# Altium project MASTER.PrjPcb (part 2 of 3)

## Sheet Vesc_Simple_2.SchDoc
size C
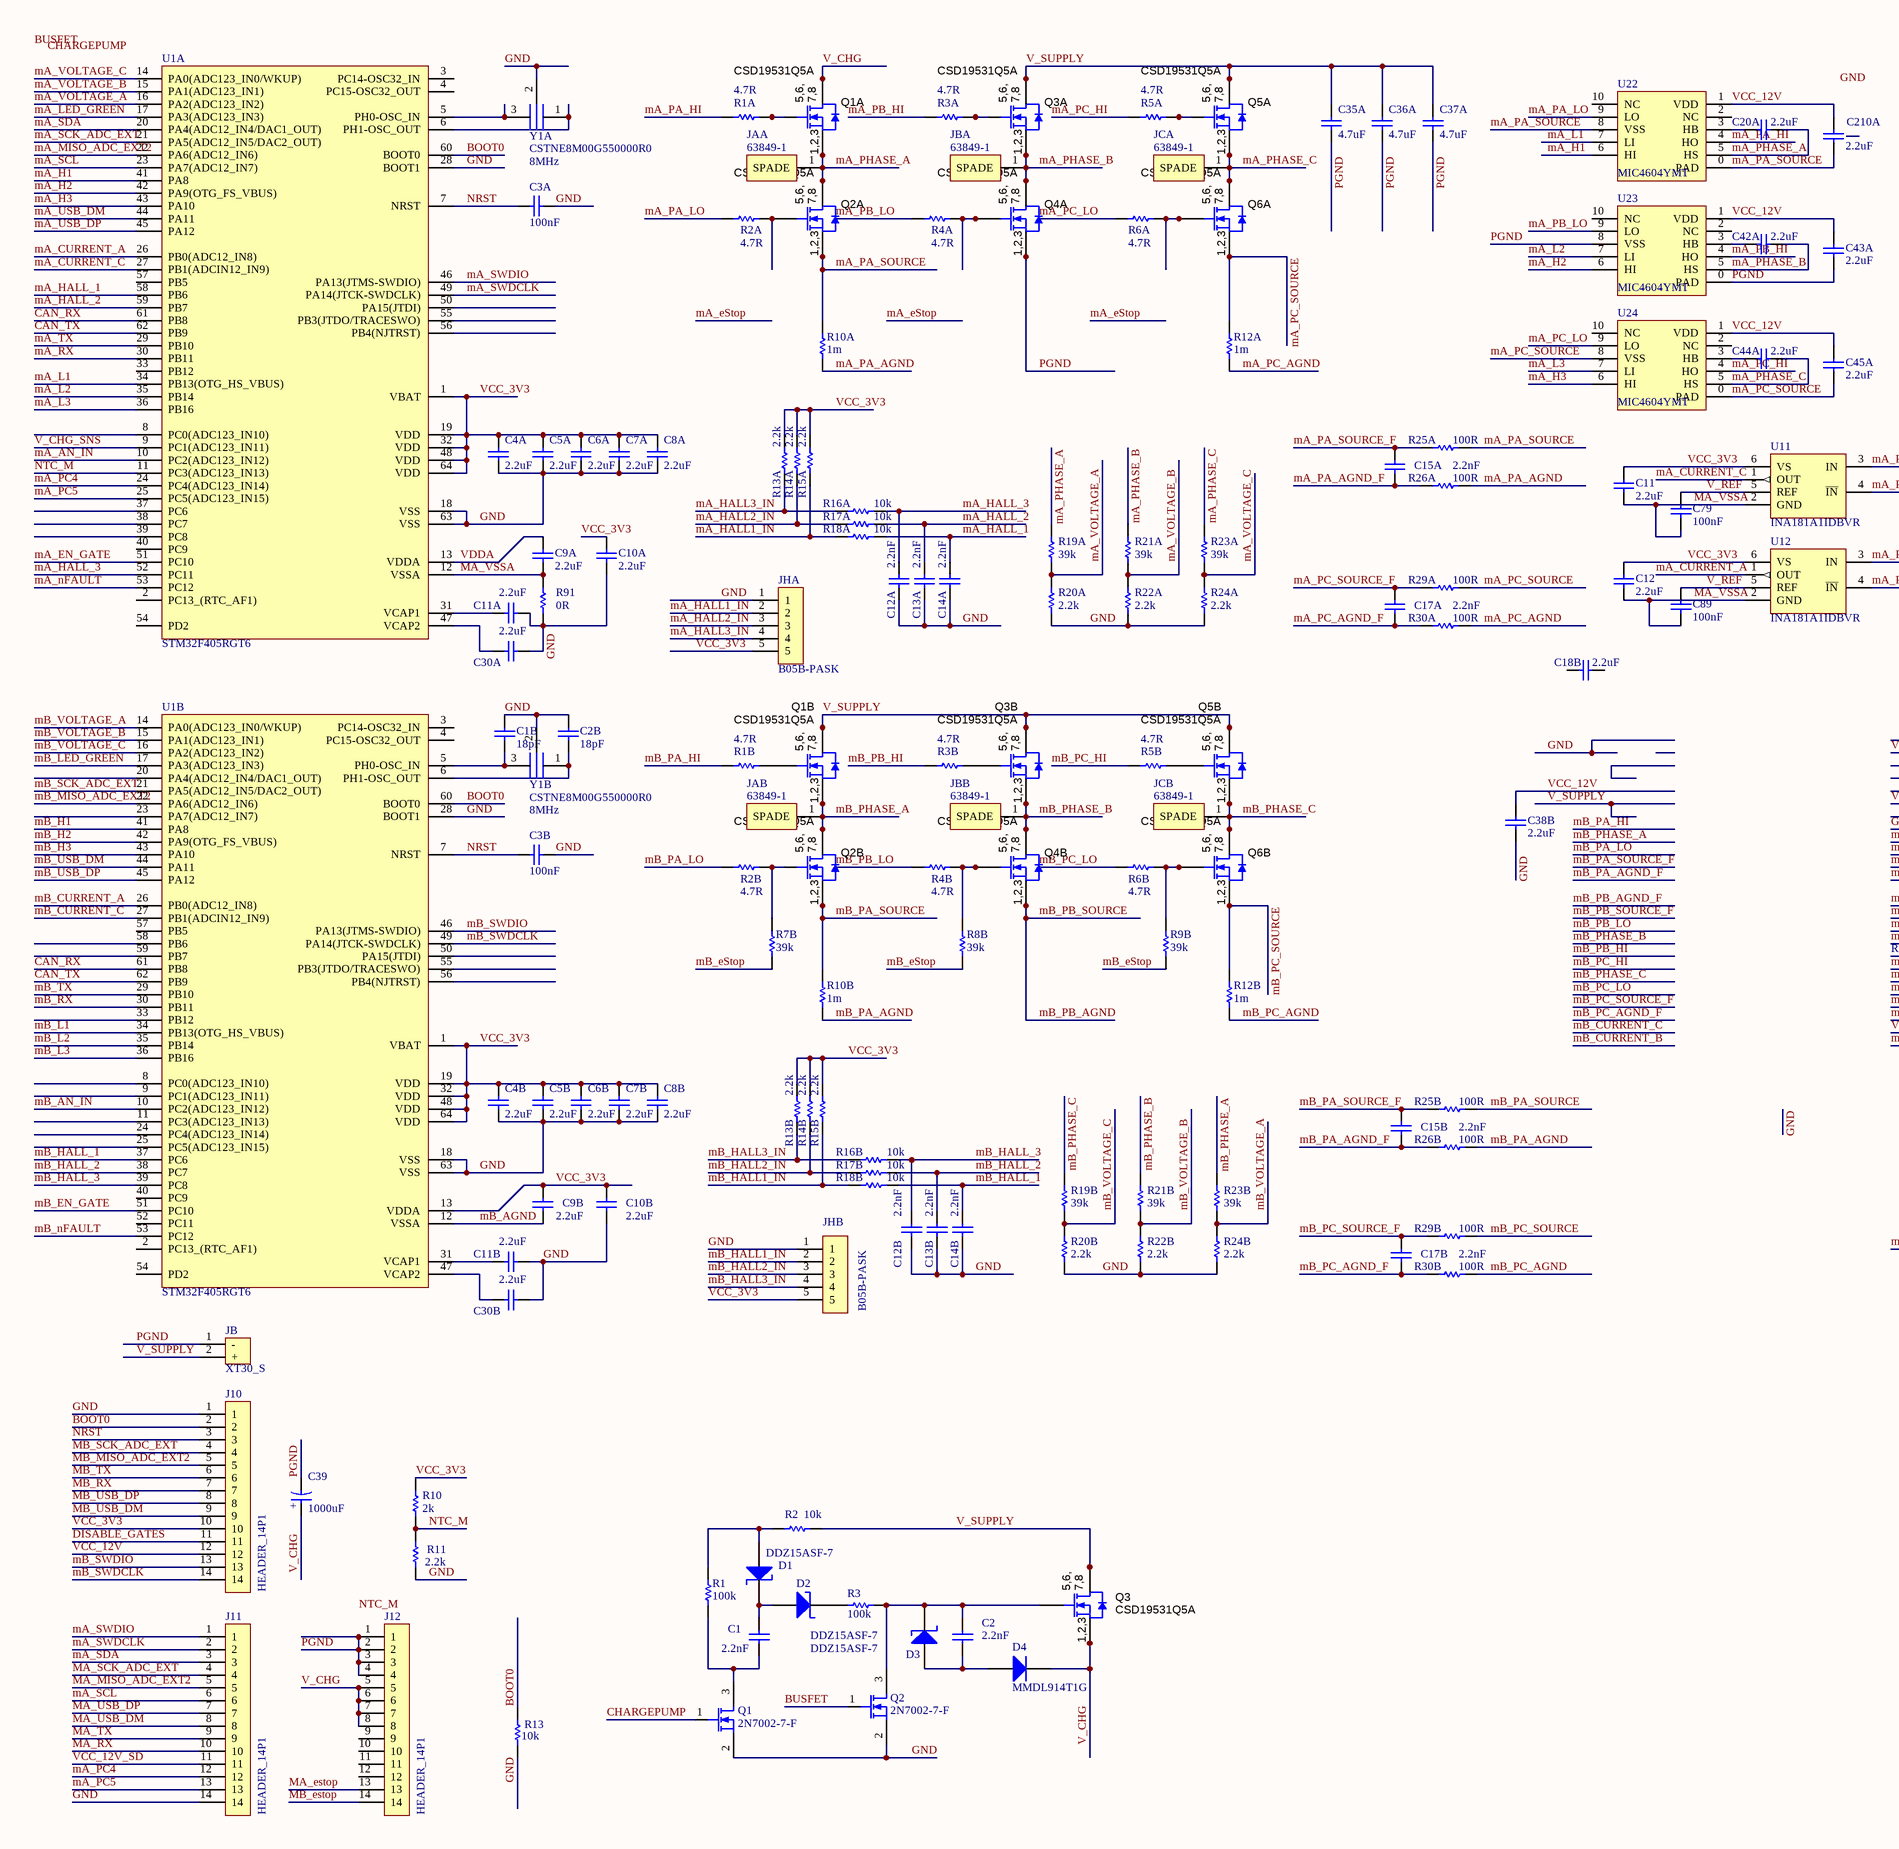
[diagram p3: Vesc_Simple_2.SchDoc, left]
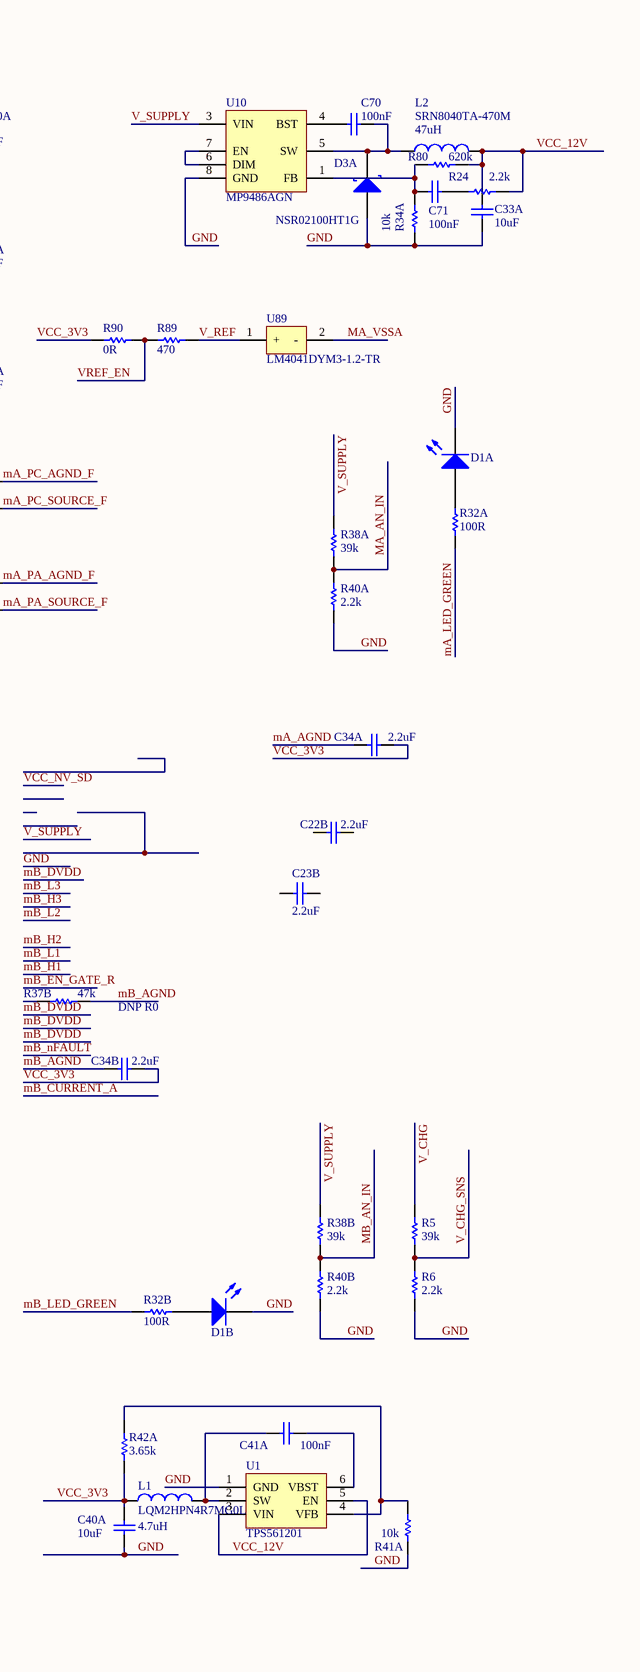
[diagram p4: Vesc_Simple_2.SchDoc, right]

### Parts
(Parts that share a designator on the sheet are numbered #1, #2 ... from top to bottom, then left to right.)
C1  value 2.2nF  [CAP 0402]  (hidden comment: GCM155R72A222KA37D)
C1B#2  value 18pF  [CAP 0402]  (hidden comment: GCM1555C1H180JA16D)
C2  value 2.2nF  [CAP 0402]  (hidden comment: GCM155R72A222KA37D)
C2B#2  value 18pF  [CAP 0402]  (hidden comment: GCM1555C1H180JA16D)
C3A#2  value 100nF  [CAP 0402]  (hidden comment: C0402C104K3RACTU)
C3B#2  value 100nF  [CAP 0402]  (hidden comment: C0402C104K3RACTU)
C4A#2  value 2.2uF  [CAP 0402]  (hidden comment: GRM155C81C225ME15D)
C4B#2  value 2.2uF  [CAP 0402]  (hidden comment: GRM155C81C225ME15D)
C5A#2  value 2.2uF  [CAP 0402]  (hidden comment: GRM155C81C225ME15D)
C5B#2  value 2.2uF  [CAP 0402]  (hidden comment: GRM155C81C225ME15D)
C6A#2  value 2.2uF  [CAP 0402]  (hidden comment: GRM155C81C225ME15D)
C6B#2  value 2.2uF  [CAP 0402]  (hidden comment: GRM155C81C225ME15D)
C7A#2  value 2.2uF  [CAP 0402]  (hidden comment: GRM155C81C225ME15D)
C7B#2  value 2.2uF  [CAP 0402]  (hidden comment: GRM155C81C225ME15D)
C8A#2  value 2.2uF  [CAP 0402]  (hidden comment: GRM155C81C225ME15D)
C8B#2  value 2.2uF  [CAP 0402]  (hidden comment: GRM155C81C225ME15D)
C9A#2  value 2.2uF  [CAP 0402]  (hidden comment: GRM155C81C225ME15D)
C9B#2  value 2.2uF  [CAP 0402]  (hidden comment: GRM155C81C225ME15D)
C10A#2  value 2.2uF  [CAP 0402]  (hidden comment: GRM155C81C225ME15D)
C10B#2  value 2.2uF  [CAP 0402]  (hidden comment: GRM155C81C225ME15D)
C11#1  value 2.2uF  [CAP 0402]  (hidden comment: GRM155C81C225ME15D)
C11A#2  value 2.2uF  [CAP 0402]  (hidden comment: GRM155C81C225ME15D)
C11B#2  value 2.2uF  [CAP 0402]  (hidden comment: GRM155C81C225ME15D)
C12  value 2.2uF  [CAP 0402]  (hidden comment: GRM155C81C225ME15D)
C12A#2  value 2.2nF  [CAP 0402]  (hidden comment: GCM155R72A222KA37D)
C12B#2  value 2.2nF  [CAP 0402]  (hidden comment: GCM155R72A222KA37D)
C13A#2  value 2.2nF  [CAP 0402]  (hidden comment: GCM155R72A222KA37D)
C13B#2  value 2.2nF  [CAP 0402]  (hidden comment: GCM155R72A222KA37D)
C14A#2  value 2.2nF  [CAP 0402]  (hidden comment: GCM155R72A222KA37D)
C14B#2  value 2.2nF  [CAP 0402]  (hidden comment: GCM155R72A222KA37D)
C15A#2  value 2.2nF  [CAP 0402]  (hidden comment: GCM155R72A222KA37D)
C15B#2  value 2.2nF  [CAP 0402]  (hidden comment: GCM155R72A222KA37D)
C17A#2  value 2.2nF  [CAP 0402]  (hidden comment: GCM155R72A222KA37D)
C17B#2  value 2.2nF  [CAP 0402]  (hidden comment: GCM155R72A222KA37D)
C18B#2  value 2.2uF  [CAP 0402]  (hidden comment: GRM155C81C225ME15D)
C20A#2  value 2.2uF  [CAP 0402]  (hidden comment: GRM155C81C225ME15D)
C22B#2  value 2.2uF  [CAP 0402]  (hidden comment: GRM155C81C225ME15D)
C23B#2  value 2.2uF  [CAP 0402]  (hidden comment: GRM155C81C225ME15D)
C30A#2  value 2.2uF  [CAP 0402]  (hidden comment: GRM155C81C225ME15D)
C30B#2  value 2.2uF  [CAP 0402]  (hidden comment: GRM155C81C225ME15D)
C33A#2  value 10uF  [CAP 1206]  (hidden comment: TMK316AB7106KL-T)
C34A#2  value 2.2uF  [CAP 0402]  (hidden comment: GRM155C81C225ME15D)
C34B#2  value 2.2uF  [CAP 0402]  (hidden comment: GRM155C81C225ME15D)
C35A#2  value 4.7uF  [CAP 1210]  (hidden comment: CGA6M3X7S2A475M200AB)
C36A#2  value 4.7uF  [CAP 1210]  (hidden comment: CGA6M3X7S2A475M200AB)
C37A#2  value 4.7uF  [CAP 1210]  (hidden comment: CGA6M3X7S2A475M200AB)
C38B#2  value 2.2uF  [CAP 0402]  (hidden comment: GRM155C81C225ME15D)
C39#2  value 1000uF  [CAP 7.5mm Bent]  (hidden comment: 108CKS100MRY)
C40A#1  value 10uF  [CAP 1206]  (hidden comment: TMK316AB7106KL-T)
C41A#1  value 100nF  [CAP 0402]  (hidden comment: C0402C104K3RACTU)
C42A  value 2.2uF  [CAP 0402]  (hidden comment: GRM155C81C225ME15D)
C43A  value 2.2uF  [CAP 0402]  (hidden comment: GRM155C81C225ME15D)
C44A  value 2.2uF  [CAP 0402]  (hidden comment: GRM155C81C225ME15D)
C45A  value 2.2uF  [CAP 0402]  (hidden comment: GRM155C81C225ME15D)
C70  value 100nF  [CAP 0402]  (hidden comment: C0402C104K3RACTU)
C71  value 100nF  [CAP 0402]  (hidden comment: C0402C104K3RACTU)
C79  value 100nF  [CAP 0402]  (hidden comment: C0402C104K3RACTU)
C89  value 100nF  [CAP 0402]  (hidden comment: C0402C104K3RACTU)
C210A  value 2.2uF  [CAP 0402]  (hidden comment: GRM155C81C225ME15D)
D1  DDZ15ASF-7  [SOD-323/SC76]
D1A#2  LTST-C190KRKT  [LED 0603]  (value not drawn)
D1B#2  LTST-C190KRKT  [LED 0603]  (value not drawn)
D2  DDZ15ASF-7  [SOD-323/SC76]
D3  DDZ15ASF-7  [SOD-323/SC76]
D3A#2  NSR02100HT1G  [SOD-323/SC76]
D4  MMDL914T1G  [SOD-323/SC76]
J10#3  HEADER_14P1  [HEADER_14P1_FEMALE_TH]
J11#3  HEADER_14P1  [HEADER_14P1_FEMALE_TH]
J12#3  HEADER_14P1  [HEADER_14P1_FEMALE_TH]
JAA#2  63849-1  [63849-1]
JAB#2  63849-1  [63849-1]
JB#3  XT30_S  [XT30 SOCKET]
JBA#2  63849-1  [63849-1]
JBB#2  63849-1  [63849-1]
JCA#2  63849-1  [63849-1]
JCB#2  63849-1  [63849-1]
JHA#2  B05B-PASK  [B05B-PASK]
JHB#2  B05B-PASK  [B05B-PASK]
L1#1  LQM2HPN4R7MG0L  value 4.7uH  [IND 1008]
L2  SRN8040TA-470M  value 47uH  [SRN8040TA]
Q1  2N7002-7-F  [SOT-23-3]
Q1A#2  CSD19531Q5A  [VSONP-8]
Q1B#2  CSD19531Q5A  [VSONP-8]
Q2  2N7002-7-F  [SOT-23-3]
Q2A#2  CSD19531Q5A  [VSONP-8]
Q2B#2  CSD19531Q5A  [VSONP-8]
Q3  CSD19531Q5A  [VSONP-8]
Q3A#2  CSD19531Q5A  [VSONP-8]
Q3B#2  CSD19531Q5A  [VSONP-8]
Q4A#2  CSD19531Q5A  [VSONP-8]
Q4B#2  CSD19531Q5A  [VSONP-8]
Q5A#2  CSD19531Q5A  [VSONP-8]
Q5B#2  CSD19531Q5A  [VSONP-8]
Q6A#2  CSD19531Q5A  [VSONP-8]
Q6B#2  CSD19531Q5A  [VSONP-8]
R1  value 100k  [RES 0402]  (hidden comment: ERJ-2RKF1003X)
R1A#2  value 4.7R  [RES 0402]  (hidden comment: ERJ-PA3J4R7V)
R1B#2  value 4.7R  [RES 0402]  (hidden comment: ERJ-PA3J4R7V)
R2#1  value 10k  [RES 0402]  (hidden comment: ERJ-2RKF1002X)
R2A#2  value 4.7R  [RES 0402]  (hidden comment: ERJ-PA3J4R7V)
R2B#2  value 4.7R  [RES 0402]  (hidden comment: ERJ-PA3J4R7V)
R3#1  value 100k  [RES 0402]  (hidden comment: ERJ-2RKF1003X)
R3A#2  value 4.7R  [RES 0402]  (hidden comment: ERJ-PA3J4R7V)
R3B#2  value 4.7R  [RES 0402]  (hidden comment: ERJ-PA3J4R7V)
R4A#2  value 4.7R  [RES 0402]  (hidden comment: ERJ-PA3J4R7V)
R4B#2  value 4.7R  [RES 0402]  (hidden comment: ERJ-PA3J4R7V)
R5#1  value 39k  [RES 0402]  (hidden comment: ERJ-2RKF3902X)
R5A#2  value 4.7R  [RES 0402]  (hidden comment: ERJ-PA3J4R7V)
R5B#2  value 4.7R  [RES 0402]  (hidden comment: ERJ-PA3J4R7V)
R6#1  value 2.2k  [RES 0402]  (hidden comment: ERJ-2RKF2201X)
R6A#2  value 4.7R  [RES 0402]  (hidden comment: ERJ-PA3J4R7V)
R6B#2  value 4.7R  [RES 0402]  (hidden comment: ERJ-PA3J4R7V)
R7B#2  value 39k  [RES 0402]  (hidden comment: ERJ-2RKF3902X)
R8B#2  value 39k  [RES 0402]  (hidden comment: ERJ-2RKF3902X)
R9B#2  value 39k  [RES 0402]  (hidden comment: ERJ-2RKF3902X)
R10#2  value 2k  [RES 0402]  (hidden comment: ERT-J0EG202GM)
R10A#2  value 1m  [WSL2726]  (hidden comment: WSL27262L000FEB)
R10B#2  value 1m  [WSL2726]  (hidden comment: WSL27262L000FEB)
R11#2  value 2.2k  [RES 0402]  (hidden comment: ERJ-2RKF2201X)
R12A#2  value 1m  [WSL2726]  (hidden comment: WSL27262L000FEB)
R12B#2  value 1m  [WSL2726]  (hidden comment: WSL27262L000FEB)
R13#2  value 10k  [RES 0402]  (hidden comment: ERJ-2RKF1002X)
R13A#3  value 2.2k  [RES 0402]  (hidden comment: ERJ-2RKF2201X)
R13B#3  value 2.2k  [RES 0402]  (hidden comment: ERJ-2RKF2201X)
R14A#3  value 2.2k  [RES 0402]  (hidden comment: ERJ-2RKF2201X)
R14B#3  value 2.2k  [RES 0402]  (hidden comment: ERJ-2RKF2201X)
R15A#2  value 2.2k  [RES 0402]  (hidden comment: ERJ-2RKF2201X)
R15B#2  value 2.2k  [RES 0402]  (hidden comment: ERJ-2RKF2201X)
R16A#2  value 10k  [RES 0402]  (hidden comment: ERJ-2RKF1002X)
R16B#2  value 10k  [RES 0402]  (hidden comment: ERJ-2RKF1002X)
R17A#2  value 10k  [RES 0402]  (hidden comment: ERJ-2RKF1002X)
R17B#2  value 10k  [RES 0402]  (hidden comment: ERJ-2RKF1002X)
R18A#2  value 10k  [RES 0402]  (hidden comment: ERJ-2RKF1002X)
R18B#2  value 10k  [RES 0402]  (hidden comment: ERJ-2RKF1002X)
R19A#2  value 39k  [RES 0402]  (hidden comment: ERJ-2RKF3902X)
R19B#2  value 39k  [RES 0402]  (hidden comment: ERJ-2RKF3902X)
R20A#2  value 2.2k  [RES 0402]  (hidden comment: ERJ-2RKF2201X)
R20B#2  value 2.2k  [RES 0402]  (hidden comment: ERJ-2RKF2201X)
R21A#2  value 39k  [RES 0402]  (hidden comment: ERJ-2RKF3902X)
R21B#2  value 39k  [RES 0402]  (hidden comment: ERJ-2RKF3902X)
R22A#2  value 2.2k  [RES 0402]  (hidden comment: ERJ-2RKF2201X)
R22B#2  value 2.2k  [RES 0402]  (hidden comment: ERJ-2RKF2201X)
R23A#2  value 39k  [RES 0402]  (hidden comment: ERJ-2RKF3902X)
R23B#2  value 39k  [RES 0402]  (hidden comment: ERJ-2RKF3902X)
R24  value 2.2k  [RES 0402]  (hidden comment: ERJ-2RKF2201X)
R24A#2  value 2.2k  [RES 0402]  (hidden comment: ERJ-2RKF2201X)
R24B#2  value 2.2k  [RES 0402]  (hidden comment: ERJ-2RKF2201X)
R25A#2  value 100R  [RES 0402]  (hidden comment: ERJ-2RKF1000X)
R25B#2  value 100R  [RES 0402]  (hidden comment: ERJ-2RKF1000X)
R26A#2  value 100R  [RES 0402]  (hidden comment: ERJ-2RKF1000X)
R26B#2  value 100R  [RES 0402]  (hidden comment: ERJ-2RKF1000X)
R29A#2  value 100R  [RES 0402]  (hidden comment: ERJ-2RKF1000X)
R29B#2  value 100R  [RES 0402]  (hidden comment: ERJ-2RKF1000X)
R30A#2  value 100R  [RES 0402]  (hidden comment: ERJ-2RKF1000X)
R30B#2  value 100R  [RES 0402]  (hidden comment: ERJ-2RKF1000X)
R32A#2  value 100R  [RES 0402]  (hidden comment: ERJ-2RKF1000X)
R32B#2  value 100R  [RES 0402]  (hidden comment: ERJ-2RKF1000X)
R34A#2  value 10k  [RES 0402]  (hidden comment: ERJ-2RKF1002X)
R37B#2  value 47k  [RES 0402]  (hidden comment: ERJ-2RKF4702X)
R38A#2  value 39k  [RES 0402]  (hidden comment: ERJ-2RKF3902X)
R38B#2  value 39k  [RES 0402]  (hidden comment: ERJ-2RKF3902X)
R40A#2  value 2.2k  [RES 0402]  (hidden comment: ERJ-2RKF2201X)
R40B#2  value 2.2k  [RES 0402]  (hidden comment: ERJ-2RKF2201X)
R41A#1  value 10k  [RES 0402]  (hidden comment: ERJ-2RKF1002X)
R42A#1  value 3.65k  [RES 0402]  (hidden comment: ERJ-2RKF3651X)
R80  value 620k  [RES 0402]  (hidden comment: ERJ-2RKF6203X)
R89  value 470  [RES 0402]  (hidden comment: ERJ-2RKF4700X)
R90  value 0R  [RES 0402]  (hidden comment: ERJ-2GE0R00X)
R91#1  value 0R  [RES 0402]  (hidden comment: ERJ-2GE0R00X)
U1#1  TPS561201  [SOT-23-6]
U1A#2  STM32F405RGT6  [QFP-64 - P0.5MM]
U1B#2  STM32F405RGT6  [QFP-64 - P0.5MM]
U10  MP9486AGN  [SOIC-8]
U11  INA181A1IDBVR  [SOT-23-6]
U12  INA181A1IDBVR  [SOT-23-6]
U22  MIC4604YMT  [TDFN-10]
U23  MIC4604YMT  [TDFN-10]
U24  MIC4604YMT  [TDFN-10]
U89  LM4041DYM3-1.2-TR  [SOT-23-3]
Y1A#2  CSTNE8M00G550000R0  value 8MHz  [MuRata CSTN]
Y1B#2  CSTNE8M00G550000R0  value 8MHz  [MuRata CSTN]

### Nets
BOOT0: J10#3.2 R13#2.2 U1A#2.60(BOOT0) U1B#2.60(BOOT0)
BUSFET: Q2.1(G)
CAN_RX: U1A#2.61(PB8) U1B#2.61(PB8)
CAN_TX: U1A#2.62(PB9) U1B#2.62(PB9)
CHARGEPUMP: Q1.1(G)
DISABLE_GATES: J10#3.11
GND: C1B#2.2 C2B#2.2 C3A#2.2 C3B#2.2 C4A#2.2 C4B#2.2 C5A#2.2 C5B#2.2 C6A#2.2 C6B#2.2 C7A#2.2 C7B#2.2 C8A#2.2 C8B#2.2 C10A#2.2 C10B#2.2 C11A#2.2 C11B#2.2 C12A#2.1 C12B#2.1 C13A#2.1 C13B#2.1 C14A#2.1 C14B#2.1 C30A#2.2 C30B#2.2 C33A#2.2 C38B#2.2 C40A#1.2 D1A#2.2(K) D1B#2.2(K) D3A#2.1(A) J10#3.1 J11#3.14 JHA#2.1 JHB#2.1 Q1.2(S) Q2.2(S) R6#1.1 R11#2.1 R13#2.1 R20A#2.1 R20B#2.1 R22A#2.1 R22B#2.1 R24A#2.1 R24B#2.1 R34A#2.1 R40A#2.1 R40B#2.1 R41A#1.1 R91#1.1 U1#1.1(GND) U1A#2.18(VSS) U1A#2.28(BOOT1) U1A#2.63(VSS) U1B#2.18(VSS) U1B#2.28(BOOT1) U1B#2.63(VSS) U10.8(GND) Y1A#2.2 Y1B#2.2
mA_AGND: C34A#2.2
mA_AN_IN: R38A#2.1 R40A#2.2 U1A#2.10(PC2(ADC123_IN12))
mA_CURRENT_A: U1A#2.26(PB0(ADC12_IN8)) U12.1(OUT)
mA_CURRENT_C: U1A#2.27(PB1(ADCIN12_IN9)) U11.1(OUT)
mA_EN_GATE: U1A#2.51(PC10)
mA_eStop: J12#3.13
mA_H1: U1A#2.41(PA8) U22.6(HI)
mA_H2: U1A#2.42(PA9(OTG_FS_VBUS)) U23.6(HI)
mA_H3: U1A#2.43(PA10) U24.6(HI)
mA_HALL1_IN: JHA#2.2 R15A#2.1 R18A#2.1
mA_HALL2_IN: JHA#2.3 R14A#3.1 R17A#2.1
mA_HALL3_IN: JHA#2.4 R13A#3.1 R16A#2.1
mA_HALL_1: C14A#2.2 R18A#2.2 U1A#2.58(PB6)
mA_HALL_2: C13A#2.2 R17A#2.2 U1A#2.59(PB7)
mA_HALL_3: C12A#2.2 R16A#2.2 U1A#2.52(PC11)
mA_L1: U1A#2.34(PB13(OTG_HS_VBUS)) U22.7(LI)
mA_L2: U1A#2.35(PB14) U23.7(LI)
mA_L3: U1A#2.36(PB16) U24.7(LI)
mA_LED_GREEN: R32A#2.2 U1A#2.17(PA3(ADC123_IN3))
mA_MISO_ADC_EXT2: J11#3.5 U1A#2.22(PA6(ADC12_IN6))
mA_nFAULT: U1A#2.53(PC12)
mA_PA_AGND: R10A#2.1 R26A#2.2
mA_PA_AGND_F: C15A#2.1 R26A#2.1 U12.3(IN)
mA_PA_HI: R1A#2.1 U22.4(HO)
mA_PA_LO: R2A#2.1 U22.9(LO)
mA_PA_SOURCE: C35A#2.1 C36A#2.1 C37A#2.1 C39#2.1 C43A.2 C210A.2 J12#3.1 J12#3.2 J12#3.3 J12#3.4 JB#3.1(-) Q2A#2.1(S) Q2A#2.2(S) Q2A#2.3(S) Q2B#2.1(S) Q2B#2.2(S) Q2B#2.3(S) Q4A#2.1(S) Q4A#2.2(S) Q4A#2.3(S) R10A#2.2 R10B#2.2 R25A#2.2 R25B#2.2 U22.0(PAD) U22.8(VSS) U23.0(PAD) U23.8(VSS)  [also labelled mB_PA_SOURCE, PGND]
mA_PA_SOURCE_F: C15A#2.2 R25A#2.1 U12.4(~{IN})
mA_PB_HI: R3A#2.1 U23.4(HO)
mA_PB_LO: R4A#2.1 U23.9(LO)
mA_PC4: J11#3.12 U1A#2.24(PC4(ADC123_IN14))
mA_PC5: J11#3.13 U1A#2.25(PC5(ADC123_IN15))
mA_PC_AGND: R12A#2.2 R30A#2.2
mA_PC_AGND_F: C17A#2.1 R30A#2.1 U11.3(IN)
mA_PC_HI: R5A#2.1 U24.4(HO)
mA_PC_LO: R6A#2.1 U24.9(LO)
mA_PC_SOURCE: C45A.2 Q6A#2.1(S) Q6A#2.2(S) Q6A#2.3(S) R12A#2.1 R29A#2.2 U24.0(PAD) U24.8(VSS)
mA_PC_SOURCE_F: C17A#2.2 R29A#2.1 U11.4(~{IN})
mA_PHASE_A: C20A#2.1 JAA#2.1(SPADE) Q1A#2.1(S) Q1A#2.2(S) Q1A#2.3(S) Q2A#2.5(D) Q2A#2.6(D) Q2A#2.7(D) Q2A#2.8(D) Q2A#2.9(D) R19A#2.2 U22.5(HS)
mA_PHASE_B: C42A.1 JBA#2.1(SPADE) Q3A#2.1(S) Q3A#2.2(S) Q3A#2.3(S) Q4A#2.5(D) Q4A#2.6(D) Q4A#2.7(D) Q4A#2.8(D) Q4A#2.9(D) R21A#2.2 U23.5(HS)
mA_PHASE_C: C44A.1 JCA#2.1(SPADE) Q5A#2.1(S) Q5A#2.2(S) Q5A#2.3(S) Q6A#2.5(D) Q6A#2.6(D) Q6A#2.7(D) Q6A#2.8(D) Q6A#2.9(D) R23A#2.2 U24.5(HS)
mA_RX: J11#3.10 U1A#2.30(PB11)
mA_SCK_ADC_EXT: J11#3.4 U1A#2.21(PA5(ADC12_IN5/DAC2_OUT))
mA_SCL: J11#3.6 U1A#2.23(PA7(ADC12_IN7))
mA_SDA: J11#3.3 U1A#2.20(PA4(ADC12_IN4/DAC1_OUT))
mA_SWDCLK: J11#3.2 U1A#2.49(PA14(JTCK-SWDCLK))
mA_SWDIO: J11#3.1 U1A#2.46(PA13(JTMS-SWDIO))
mA_TX: J11#3.9 U1A#2.29(PB10)
mA_USB_DM: J11#3.8 U1A#2.44(PA11)
mA_USB_DP: J11#3.7 U1A#2.45(PA12)
mA_VOLTAGE_A: R19A#2.1 R20A#2.2 U1A#2.16(PA2(ADC123_IN2))
mA_VOLTAGE_B: R21A#2.1 R22A#2.2 U1A#2.15(PA1(ADC123_IN1))
mA_VOLTAGE_C: R23A#2.1 R24A#2.2 U1A#2.14(PA0(ADC123_IN0/WKUP))
MA_VSSA: C9A#2.2 C11#1.2 C12.2 C79.1 C89.1 R91#1.2 U1A#2.12(VSSA) U11.2(GND) U12.2(GND) U89.2(-)
mB_AGND: C9B#2.2 C34B#2.2 R37B#2.2 U1B#2.12(VSSA)
mB_AN_IN: R38B#2.1 R40B#2.2 U1B#2.10(PC2(ADC123_IN12))
mB_CURRENT_A: U1B#2.26(PB0(ADC12_IN8))
mB_CURRENT_C: U1B#2.27(PB1(ADCIN12_IN9))
mB_EN_GATE: U1B#2.51(PC10)
mB_eStop: J12#3.14 R7B#2.1 R8B#2.1 R9B#2.1
mB_H1: U1B#2.41(PA8)
mB_H2: U1B#2.42(PA9(OTG_FS_VBUS))
mB_H3: U1B#2.43(PA10)
mB_HALL1_IN: JHB#2.2 R15B#2.1 R18B#2.1
mB_HALL2_IN: JHB#2.3 R14B#3.1 R17B#2.1
mB_HALL3_IN: JHB#2.4 R13B#3.1 R16B#2.1
mB_HALL_1: C14B#2.2 R18B#2.2 U1B#2.37(PC6)
mB_HALL_2: C13B#2.2 R17B#2.2 U1B#2.38(PC7)
mB_HALL_3: C12B#2.2 R16B#2.2 U1B#2.39(PC8)
mB_L1: U1B#2.34(PB13(OTG_HS_VBUS))
mB_L2: U1B#2.35(PB14)
mB_L3: U1B#2.36(PB16)
mB_LED_GREEN: R32B#2.2 U1B#2.17(PA3(ADC123_IN3))
mB_MISO_ADC_EXT2: J10#3.5 U1B#2.22(PA6(ADC12_IN6))
mB_nFAULT: U1B#2.53(PC12)
mB_PA_AGND: R10B#2.1 R26B#2.2
mB_PA_AGND_F: C15B#2.1 R26B#2.1
mB_PA_HI: R1B#2.1
mB_PA_LO: R2B#2.1
mB_PA_SOURCE_F: C15B#2.2 R25B#2.1
mB_PB_AGND: Q4B#2.1(S) Q4B#2.2(S) Q4B#2.3(S)  [also labelled mB_PB_SOURCE]
mB_PB_HI: R3B#2.1
mB_PB_LO: R4B#2.1
mB_PC_AGND: R12B#2.2 R30B#2.2
mB_PC_AGND_F: C17B#2.1 R30B#2.1
mB_PC_HI: R5B#2.1
mB_PC_LO: R6B#2.1
mB_PC_SOURCE: Q6B#2.1(S) Q6B#2.2(S) Q6B#2.3(S) R12B#2.1 R29B#2.2
mB_PC_SOURCE_F: C17B#2.2 R29B#2.1
mB_PHASE_A: JAB#2.1(SPADE) Q1B#2.1(S) Q1B#2.2(S) Q1B#2.3(S) Q2B#2.5(D) Q2B#2.6(D) Q2B#2.7(D) Q2B#2.8(D) Q2B#2.9(D) R23B#2.2
mB_PHASE_B: JBB#2.1(SPADE) Q3B#2.1(S) Q3B#2.2(S) Q3B#2.3(S) Q4B#2.5(D) Q4B#2.6(D) Q4B#2.7(D) Q4B#2.8(D) Q4B#2.9(D) R21B#2.2
mB_PHASE_C: JCB#2.1(SPADE) Q5B#2.1(S) Q5B#2.2(S) Q5B#2.3(S) Q6B#2.5(D) Q6B#2.6(D) Q6B#2.7(D) Q6B#2.8(D) Q6B#2.9(D) R19B#2.2
mB_RX: J10#3.7 U1B#2.30(PB11)
mB_SCK_ADC_EXT: J10#3.4 U1B#2.21(PA5(ADC12_IN5/DAC2_OUT))
mB_SWDCLK: J10#3.14 U1B#2.49(PA14(JTCK-SWDCLK))
mB_SWDIO: J10#3.13 U1B#2.46(PA13(JTMS-SWDIO))
mB_TX: J10#3.6 U1B#2.29(PB10)
mB_USB_DM: J10#3.9 U1B#2.44(PA11)
mB_USB_DP: J10#3.8 U1B#2.45(PA12)
mB_VOLTAGE_A: R23B#2.1 R24B#2.2 U1B#2.14(PA0(ADC123_IN0/WKUP))
mB_VOLTAGE_B: R21B#2.1 R22B#2.2 U1B#2.15(PA1(ADC123_IN1))
mB_VOLTAGE_C: R19B#2.1 R20B#2.2 U1B#2.16(PA2(ADC123_IN2))
NRST: C3A#2.1 C3B#2.1 J10#3.3 U1A#2.7(NRST) U1B#2.7(NRST)
NTC_M: R10#2.1 R11#2.2 U1A#2.11(PC3(ADC123_IN13))
V_CHG: C39#2.2 D4.2(K) J12#3.5 J12#3.6 J12#3.7 J12#3.8 Q1A#2.5(D) Q1A#2.6(D) Q1A#2.7(D) Q1A#2.8(D) Q1A#2.9(D) Q3.1(S) Q3.2(S) Q3.3(S) R5#1.2
V_CHG_SNS: R5#1.1 R6#1.2 U1A#2.9(PC1(ADC123_IN11))
V_REF: C79.2 C89.2 R89.2 U11.5(REF) U12.5(REF) U89.1(+)
V_SUPPLY: C35A#2.2 C36A#2.2 C37A#2.2 JB#3.2(+) Q1B#2.5(D) Q1B#2.6(D) Q1B#2.7(D) Q1B#2.8(D) Q1B#2.9(D) Q3.5(D) Q3.6(D) Q3.7(D) Q3.8(D) Q3.9(D) Q3A#2.5(D) Q3A#2.6(D) Q3A#2.7(D) Q3A#2.8(D) Q3A#2.9(D) Q3B#2.5(D) Q3B#2.6(D) Q3B#2.7(D) Q3B#2.8(D) Q3B#2.9(D) Q5A#2.5(D) Q5A#2.6(D) Q5A#2.7(D) Q5A#2.8(D) Q5A#2.9(D) Q5B#2.5(D) Q5B#2.6(D) Q5B#2.7(D) Q5B#2.8(D) Q5B#2.9(D) R2#1.2 R38A#2.2 R38B#2.2 U10.3(VIN)
VCC_3V3: C4A#2.1 C4B#2.1 C5A#2.1 C5B#2.1 C6A#2.1 C6B#2.1 C7A#2.1 C7B#2.1 C8A#2.1 C8B#2.1 C9B#2.1 C10A#2.1 C10B#2.1 C11#1.1 C12.1 C34A#2.1 C34B#2.1 C40A#1.1 J10#3.10 JHA#2.5 JHB#2.5 L1#1.1 R10#2.2 R13A#3.2 R13B#3.2 R14A#3.2 R14B#3.2 R15A#2.2 R15B#2.2 R42A#1.1 R90.1 U1A#2.1(VBAT) U1A#2.19(VDD) U1A#2.32(VDD) U1A#2.48(VDD) U1A#2.64(VDD) U1B#2.1(VBAT) U1B#2.13(VDDA) U1B#2.19(VDD) U1B#2.32(VDD) U1B#2.48(VDD) U1B#2.64(VDD) U11.6(VS) U12.6(VS)
VCC_12V: C33A#2.1 C38B#2.1 C43A.1 C45A.1 C210A.1 J10#3.12 L2.2 R24.1 R80.2 U1#1.3(VIN) U1#1.5(EN) U22.1(VDD) U23.1(VDD) U24.1(VDD)
VCC_12V_SD: J11#3.11
VDDA: C9A#2.1 U1A#2.13(VDDA)
VREF_EN: R89.1 R90.2
NetC1_1: C1.1 Q1.3(D) R1.1
NetC1_2: C1.2 D1.2(K) D2.1(A2)
NetC1B#2_1: C1B#2.1 U1B#2.5(PH0-OSC_IN) Y1B#2.3
NetC2_1: C2.1 D3.1(A2) D4.1(A)
NetC2_2: C2.2 D3.2(K) Q2.3(D) Q3.4(G) R3#1.2
NetC2B#2_1: C2B#2.1 U1B#2.6(PH1-OSC_OUT) Y1B#2.1
NetC11A#2_1: C11A#2.1 U1A#2.31(VCAP1)
NetC11B#2_1: C11B#2.1 U1B#2.31(VCAP1)
NetC20A#2_2: C20A#2.2 U22.3(HB)
NetC30A#2_1: C30A#2.1 U1A#2.47(VCAP2)
NetC30B#2_1: C30B#2.1 U1B#2.47(VCAP2)
NetC41A#1_1: C41A#1.1 L1#1.2 U1#1.2(SW)
NetC41A#1_2: C41A#1.2 U1#1.6(VBST)
NetC42A_2: C42A.2 U23.3(HB)
NetC44A_2: C44A.2 U24.3(HB)
NetC70_1: C70.1 D3A#2.2(K) L2.1 U10.5(SW)
NetC70_2: C70.2 U10.4(BST)
NetC71_1: C71.1 R34A#2.2 R80.1 U10.1(FB)
NetC71_2: C71.2 R24.2
NetD1_1: D1.1(A2) R1.2 R2#1.1
NetD1A#2_1: D1A#2.1(A) R32A#2.1
NetD1B#2_1: D1B#2.1(A) R32B#2.1
NetD2_2: D2.2(K) R3#1.1
NetQ1A#2_4: Q1A#2.4(G) R1A#2.2
NetQ1B#2_4: Q1B#2.4(G) R1B#2.2
NetQ2A#2_4: Q2A#2.4(G) R2A#2.2
NetQ2B#2_4: Q2B#2.4(G) R2B#2.2 R7B#2.2
NetQ3A#2_4: Q3A#2.4(G) R3A#2.2
NetQ3B#2_4: Q3B#2.4(G) R3B#2.2
NetQ4A#2_4: Q4A#2.4(G) R4A#2.2
NetQ4B#2_4: Q4B#2.4(G) R4B#2.2 R8B#2.2
NetQ5A#2_4: Q5A#2.4(G) R5A#2.2
NetQ5B#2_4: Q5B#2.4(G) R5B#2.2
NetQ6A#2_4: Q6A#2.4(G) R6A#2.2
NetQ6B#2_4: Q6B#2.4(G) R6B#2.2 R9B#2.2
NetR41A#1_2: R41A#1.2 R42A#1.2 U1#1.4(VFB)
NetU1A#2_5: U1A#2.5(PH0-OSC_IN) Y1A#2.3
NetU1A#2_6: U1A#2.6(PH1-OSC_OUT) Y1A#2.1
NetU10_6: U10.6(DIM) U10.7(EN)

Not connected (* = marked no-connect by the designer): C18B#2 1 2; C22B#2 1 2; C23B#2 1 2; J12#3 9 10 11 12; R37B#2 1; U1A#2 2(PC13_(RTC_AF1)) 3(PC14-OSC32_IN) 4(PC15-OSC32_OUT) 8(PC0(ADC123_IN10)) 33(PB12) 37(PC6) 38(PC7) 39(PC8) 40(PC9) 50(PA15(JTDI)) 54(PD2) 55(PB3(JTDO/TRACESWO)) 56(PB4(NJTRST)) 57(PB5); U1B#2 2(PC13_(RTC_AF1)) 3(PC14-OSC32_IN) 4(PC15-OSC32_OUT) 8(PC0(ADC123_IN10)) 9(PC1(ADC123_IN11)) 11(PC3(ADC123_IN13)) 20(PA4(ADC12_IN4/DAC1_OUT)) 23(PA7(ADC12_IN7)) 24(PC4(ADC123_IN14)) 25(PC5(ADC123_IN15)) 33(PB12) 40(PC9) 50(PA15(JTDI)) 52(PC11) 54(PD2) 55(PB3(JTDO/TRACESWO)) 56(PB4(NJTRST)) 57(PB5) 58(PB6) 59(PB7); U22 2(NC) 10(NC); U23 2(NC) 10(NC); U24 2(NC) 10(NC)

### Notes on the sheet
- DNP R0
- Labels drawn without touching a wire or pin: BUSFET, CHARGEPUMP, GND, NTC_M
- (in symbol 108CKS100MRY) +
- (in symbol CSD19531Q5A) 5,6,; 7,8; 1,2,3

### Library data of the parts
C1 C2 C12A#2 C12B#2 C13A#2 C13B#2 C14A#2 C14B#2 C15A#2 C15B#2 C17A#2 C17B#2 = GCM155R72A222KA37D: as C12A#1 on sheet Vesc
C1B#2 C2B#2 = GCM1555C1H180JA16D: as C1A on sheet Vesc
C3A#2 C3B#2 C41A#1 C70 C71 C79 C89 = C0402C104K3RACTU: CAP 0402 100nF 10V; WVDC: 25
C4A#2 C4B#2 C5A#2 C5B#2 C6A#2 C6B#2 C7A#2 C7B#2 C8A#2 C8B#2 C9A#2 C9B#2 C10A#2 C10B#2 C11#1 C11A#2 C11B#2 C12 C18B#2 C20A#2 C22B#2 C23B#2 C30A#2 C30B#2 C34A#2 C34B#2 C38B#2 C42A C43A C44A C45A C210A = GRM155C81C225ME15D: CAP 0402 2.2uF 16V; WVDC: 16
C33A#2 C40A#1 = TMK316AB7106KL-T: CAP 1206 10uF 25V; WVDC: 25
C35A#2 C36A#2 C37A#2 = CGA6M3X7S2A475M200AB: CAP 1206 4.7uF 100V; WVDC: 100
C39#2 = 108CKS100MRY: CAP 7.5mm Radial 1000uF 100V; WVDC: 100
D1-D3 = DDZ15ASF-7: Zener Diodes 500mW 13.785V Zener .9V Vf; Vrrm: 13.7; If: 200mA
D1A#2 D1B#2 = LTST-C190KRKT: RED LED
D3A#2 = NSR02100HT1G: as D3A#1 on sheet Vesc
D4 = MMDL914T1G: General Purpose Diodes & Rectifiers 100V; Vrrm: 100; If: 200mA
J10#3 J11#3 J12#3 = HEADER_14P1: 2.54mm Header 14 Pin 1 Row
JAA#2 JAB#2 JBA#2 JBB#2 JCA#2 JCB#2 = 63849-1: SPADE CONNECTOR BOARD MOUNT
JB#3 = XT30_S: XT30 SOCKET
L1#1 = LQM2HPN4R7MG0L: Fixed Inductors 1008 4.7uH 20% 1.1A
L2 = SRN8040TA-470M: Fixed Inductors 47uH 20% 1.7A non-shdSMD AEC-Q200; Isat: 2A
Q1 Q2 = 2N7002-7-F: MOSFET 60V 200mW
Q1A#2 Q1B#2 Q2A#2 Q2B#2 Q3 Q3A#2 Q3B#2 Q4A#2 Q4B#2 Q5A#2 Q5B#2 Q6A#2 Q6B#2 = CSD19531Q5A: as Q1A#1 on sheet Vesc; PartNumber: CSD19531Q5A; Value: 100V; VdsMax_V: 100V; Vgs_V: 100V; IdsMax_A: 100A; RoHS: Y; ComponentLink1Description: Datasheet link
R1 R3#1 = ERJ-2RKF1003X: RES 0402 100k 1%
R1A#2 R1B#2 R2A#2 R2B#2 R3A#2 R3B#2 R4A#2 R4B#2 R5A#2 R5B#2 R6A#2 R6B#2 = ERJ-PA3J4R7V: RES 0402 4.7R 5%
R2#1 R13#2 R16A#2 R16B#2 R17A#2 R17B#2 R18A#2 R18B#2 R34A#2 R41A#1 = ERJ-2RKF1002X: RES 0402 10k 1%
R5#1 R7B#2 R8B#2 R9B#2 R19A#2 R19B#2 R21A#2 R21B#2 R23A#2 R23B#2 R38A#2 R38B#2 = ERJ-2RKF3902X: RES 0402 39k 1%
R6#1 R11#2 R13A#3 R13B#3 R14A#3 R14B#3 R15A#2 R15B#2 R20A#2 R20B#2 R22A#2 R22B#2 R24 R24A#2 R24B#2 R40A#2 R40B#2 = ERJ-2RKF2201X: RES 0402 2.2k 1%
R10#2 = ERT-J0EG202GM: NTC THERMISTOR 0402 2k 2%
R10A#2 R10B#2 R12A#2 R12B#2 = WSL27262L000FEB: RES 2726 1mOhm 1%
R25A#2 R25B#2 R26A#2 R26B#2 R29A#2 R29B#2 R30A#2 R30B#2 R32A#2 R32B#2 = ERJ-2RKF1000X: RES 0402 100R 1%
R37B#2 = ERJ-2RKF4702X: RES 0402 47k 1%
R42A#1 = ERJ-2RKF3651X: RES 0402 3.65k 1%
R80 = ERJ-2RKF6203X: RES 0402 620K 1%
R89 = ERJ-2RKF4700X: RES 0402 470 1%
R90 R91#1 = ERJ-2GE0R00X: RES 0402 0R
U1#1 = TPS561201: 4.5V to 17V Input, 1A Synchronous Step-Down Voltage Regulator in 6-pin SOT-23
U1A#2 U1B#2 = STM32F405RGT6: Cortex M4 MCU
U10 = MP9486AGN: Switching Voltage Regulators 100V Input
U11 U12 = INA181A1IDBVR: Current Sense Amplifiers 20V/V
U22-U24 = MIC4604YMT: 85V Half Bridge Driver
U89 = LM4041DYM3-1.2-TR: Voltage References Fixed 1.225V
Y1A#2 Y1B#2 = CSTNE8M00G550000R0: Ceramic Resonator 8.0000MHz 33pf 0.5%

## Sheet OverDrive.SchDoc
size C
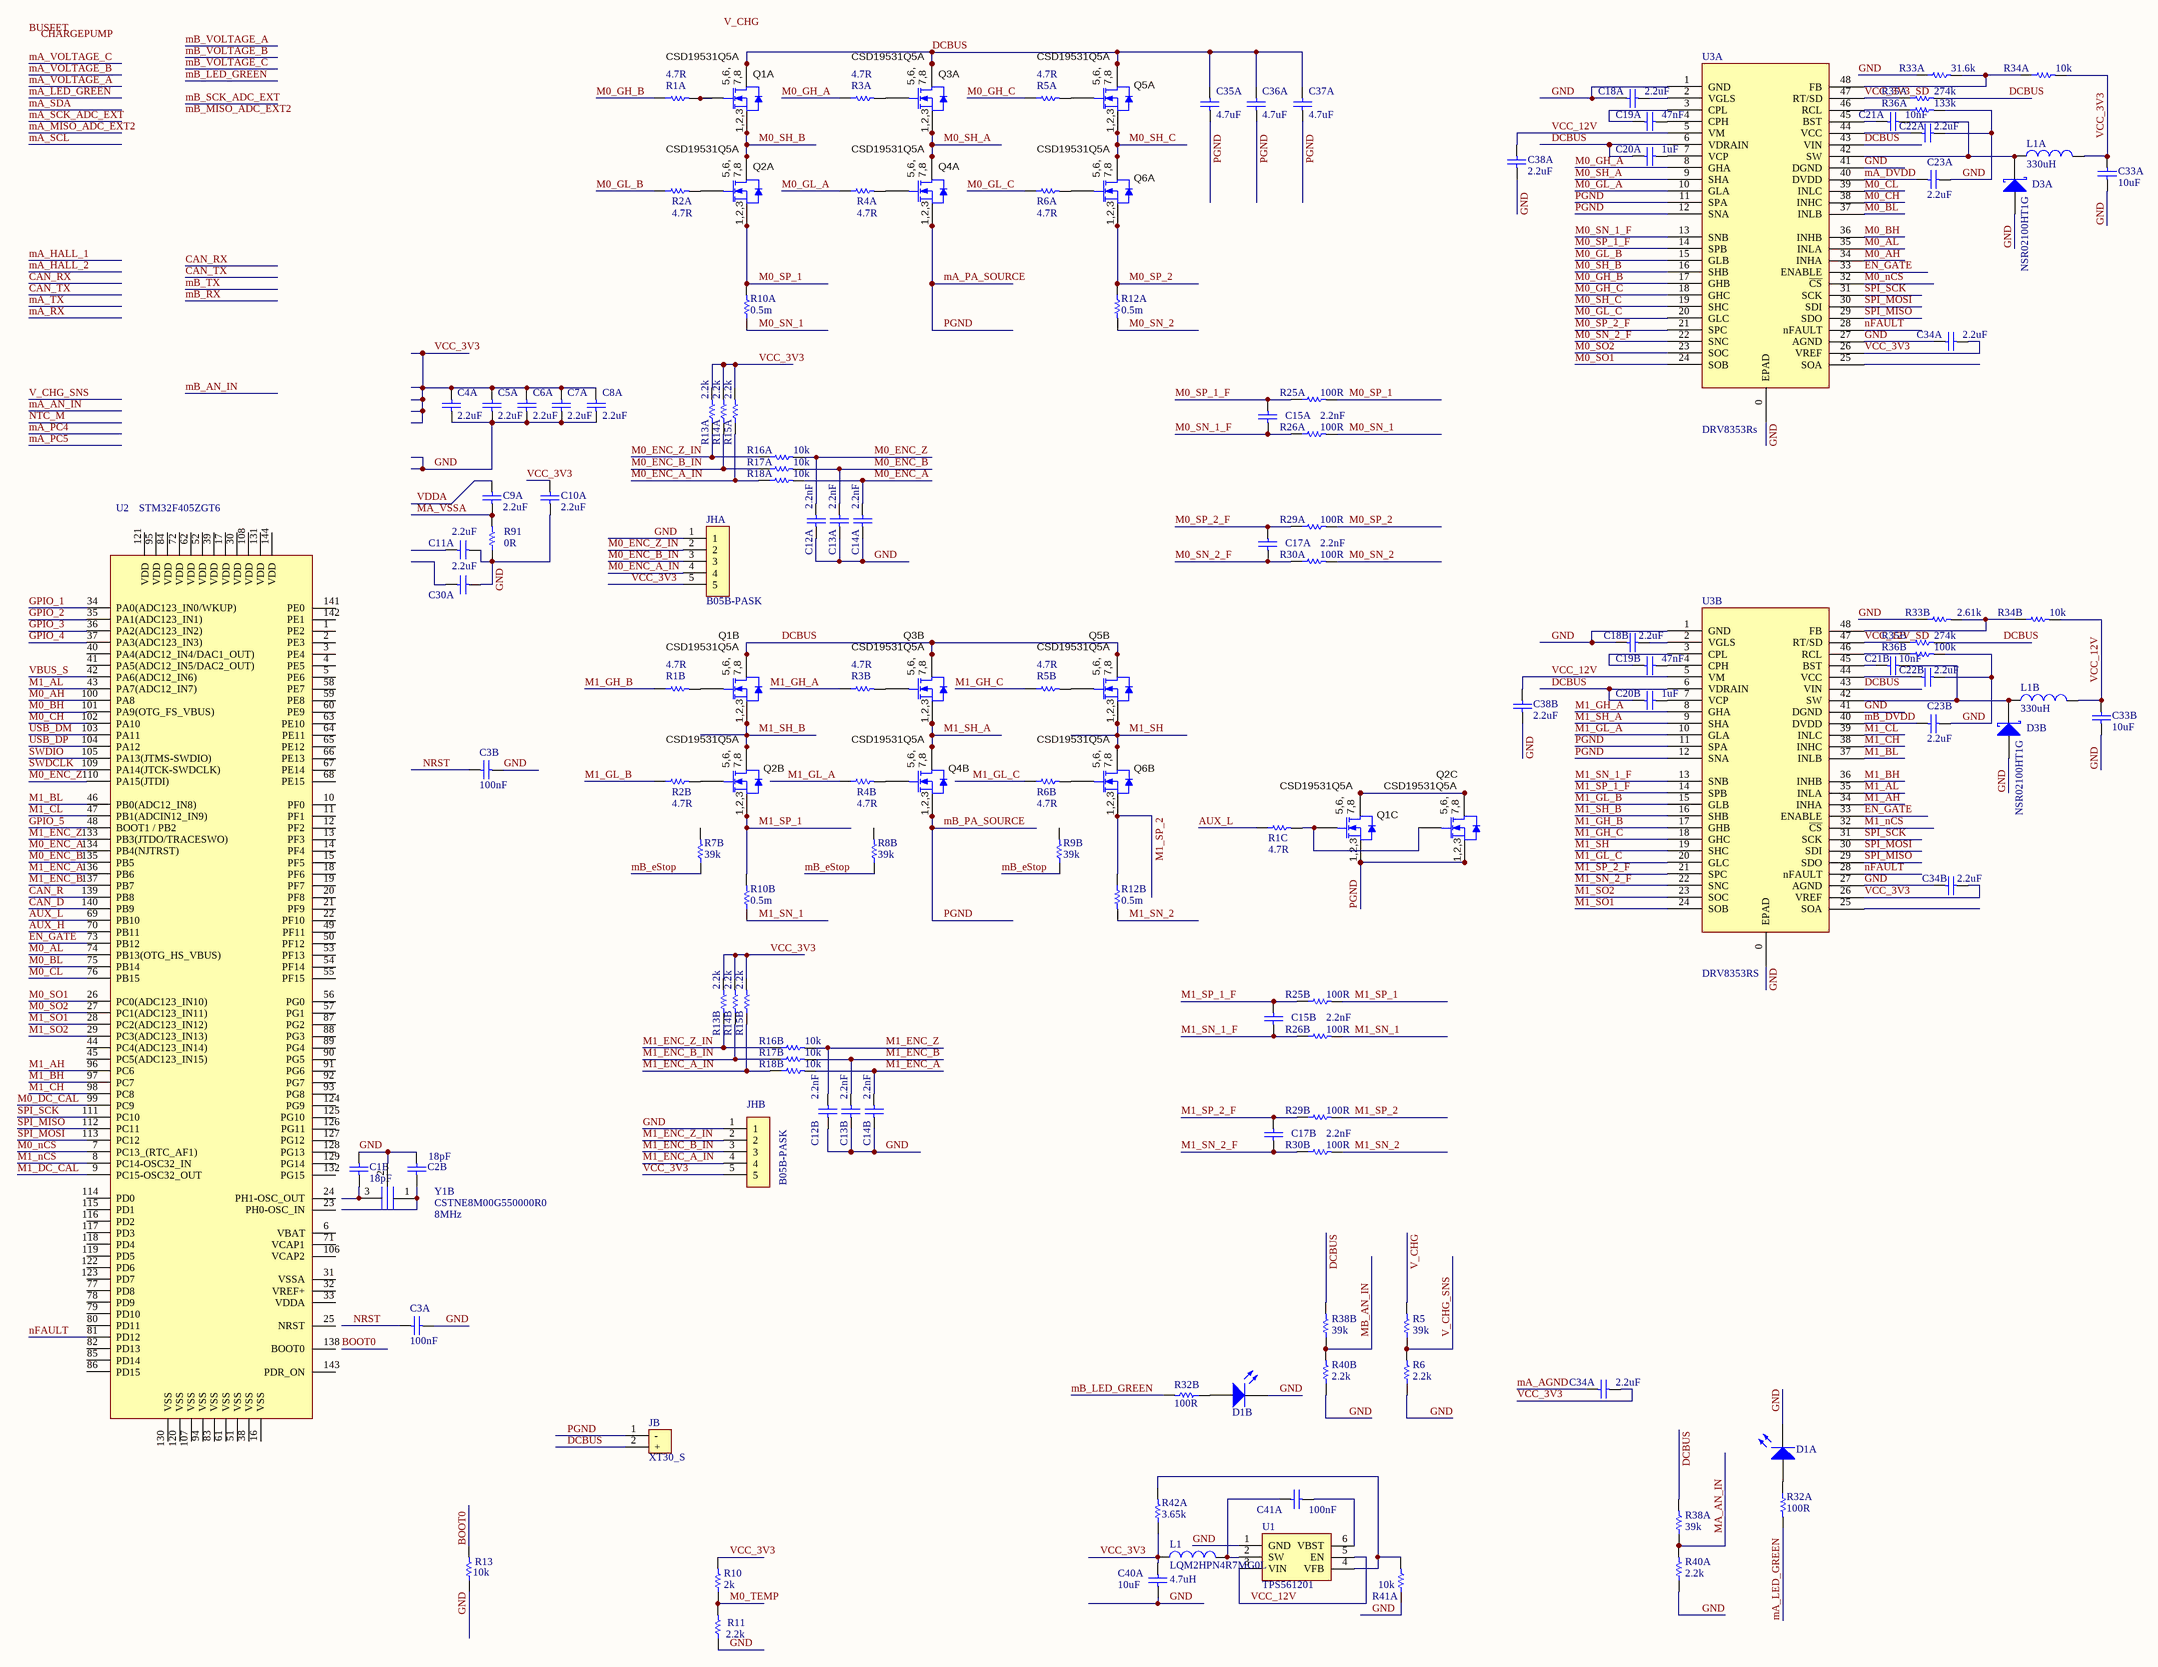
[diagram p5: OverDrive.SchDoc]

### Parts
(Parts that share a designator on the sheet are numbered #1, #2 ... from top to bottom, then left to right.)
C1B#3  value 18pF  [CAP 0402]  (hidden comment: GCM1555C1H180JA16D)
C2B#3  value 18pF  [CAP 0402]  (hidden comment: GCM1555C1H180JA16D)
C3A#3  value 100nF  [CAP 0402]  (hidden comment: C0402C104K3RACTU)
C3B#3  value 100nF  [CAP 0402]  (hidden comment: C0402C104K3RACTU)
C4A#3  value 2.2uF  [CAP 0402]  (hidden comment: GRM155C81C225ME15D)
C5A#3  value 2.2uF  [CAP 0402]  (hidden comment: GRM155C81C225ME15D)
C6A#3  value 2.2uF  [CAP 0402]  (hidden comment: GRM155C81C225ME15D)
C7A#3  value 2.2uF  [CAP 0402]  (hidden comment: GRM155C81C225ME15D)
C8A#3  value 2.2uF  [CAP 0402]  (hidden comment: GRM155C81C225ME15D)
C9A#3  value 2.2uF  [CAP 0402]  (hidden comment: GRM155C81C225ME15D)
C10A#3  value 2.2uF  [CAP 0402]  (hidden comment: GRM155C81C225ME15D)
C11A#3  value 2.2uF  [CAP 0402]  (hidden comment: GRM155C81C225ME15D)
C12A#3  value 2.2nF  [CAP 0402]  (hidden comment: GCM155R72A222KA37D)
C12B#3  value 2.2nF  [CAP 0402]  (hidden comment: GCM155R72A222KA37D)
C13A#3  value 2.2nF  [CAP 0402]  (hidden comment: GCM155R72A222KA37D)
C13B#3  value 2.2nF  [CAP 0402]  (hidden comment: GCM155R72A222KA37D)
C14A#3  value 2.2nF  [CAP 0402]  (hidden comment: GCM155R72A222KA37D)
C14B#3  value 2.2nF  [CAP 0402]  (hidden comment: GCM155R72A222KA37D)
C15A#3  value 2.2nF  [CAP 0402]  (hidden comment: GCM155R72A222KA37D)
C15B#3  value 2.2nF  [CAP 0402]  (hidden comment: GCM155R72A222KA37D)
C17A#3  value 2.2nF  [CAP 0402]  (hidden comment: GCM155R72A222KA37D)
C17B#3  value 2.2nF  [CAP 0402]  (hidden comment: GCM155R72A222KA37D)
C18A#2  value 2.2uF  [CAP 0402]  (hidden comment: GRM155C81C225ME15D)
C18B#3  value 2.2uF  [CAP 0402]  (hidden comment: GRM155C81C225ME15D)
C19A#2  value 47nF  [CAP 0603]  (hidden comment: C0603C473K1RECAUTO)
C19B#2  value 47nF  [CAP 0603]  (hidden comment: C0603C473K1RECAUTO)
C20A#3  value 1uF  [CAP 1206]  (hidden comment: GRJ31CR72A105KE11L)
C20B#2  value 1uF  [CAP 1206]  (hidden comment: GRJ31CR72A105KE11L)
C21A#2  value 10nF  [CAP 0402]  (hidden comment: GCM155R71E103JA37D)
C21B#2  value 10nF  [CAP 0402]  (hidden comment: GCM155R71E103JA37D)
C22A#2  value 2.2uF  [CAP 0402]  (hidden comment: GRM155C81C225ME15D)
C22B#3  value 2.2uF  [CAP 0402]  (hidden comment: GRM155C81C225ME15D)
C23A#2  value 2.2uF  [CAP 0402]  (hidden comment: GRM155C81C225ME15D)
C23B#3  value 2.2uF  [CAP 0402]  (hidden comment: GRM155C81C225ME15D)
C30A#3  value 2.2uF  [CAP 0402]  (hidden comment: GRM155C81C225ME15D)
C33A#3  value 10uF  [CAP 1206]  (hidden comment: TMK316AB7106KL-T)
C33B#2  value 10uF  [CAP 1206]  (hidden comment: TMK316AB7106KL-T)
C34A#3  value 2.2uF  [CAP 0402]  (hidden comment: GRM155C81C225ME15D)
C34A#4  value 2.2uF  [CAP 0402]  (hidden comment: GRM155C81C225ME15D)
C34B#3  value 2.2uF  [CAP 0402]  (hidden comment: GRM155C81C225ME15D)
C35A#3  value 4.7uF  [CAP 1210]  (hidden comment: CGA6M3X7S2A475M200AB)
C36A#3  value 4.7uF  [CAP 1210]  (hidden comment: CGA6M3X7S2A475M200AB)
C37A#3  value 4.7uF  [CAP 1210]  (hidden comment: CGA6M3X7S2A475M200AB)
C38A#2  value 2.2uF  [CAP 0402]  (hidden comment: GRM155C81C225ME15D)
C38B#3  value 2.2uF  [CAP 0402]  (hidden comment: GRM155C81C225ME15D)
C40A#2  value 10uF  [CAP 1206]  (hidden comment: TMK316AB7106KL-T)
C41A#2  value 100nF  [CAP 0402]  (hidden comment: C0402C104K3RACTU)
D1A#3  LTST-C190KRKT  [LED 0603]  (value not drawn)
D1B#3  LTST-C190KRKT  [LED 0603]  (value not drawn)
D3A#3  NSR02100HT1G  [SOD-323/SC76]
D3B#2  NSR02100HT1G  [SOD-323/SC76]
JB#4  XT30_S  [XT30 SOCKET]
JHA#3  B05B-PASK  [B05B-PASK]
JHB#3  B05B-PASK  [B05B-PASK]
L1#2  LQM2HPN4R7MG0L  value 4.7uH  [IND 1008]
L1A#2  value 330uH  [SDE0805A]  (hidden comment: SDE0805A-331K)
L1B#2  value 330uH  [SDE0805A]  (hidden comment: SDE0805A-331K)
Q1A#3  CSD19531Q5A  [VSONP-8]
Q1B#3  CSD19531Q5A  [VSONP-8]
Q1C#1  CSD19531Q5A  [VSONP-8]
Q2A#3  CSD19531Q5A  [VSONP-8]
Q2B#3  CSD19531Q5A  [VSONP-8]
Q2C#1  CSD19531Q5A  [VSONP-8]
Q3A#3  CSD19531Q5A  [VSONP-8]
Q3B#3  CSD19531Q5A  [VSONP-8]
Q4A#3  CSD19531Q5A  [VSONP-8]
Q4B#3  CSD19531Q5A  [VSONP-8]
Q5A#3  CSD19531Q5A  [VSONP-8]
Q5B#3  CSD19531Q5A  [VSONP-8]
Q6A#3  CSD19531Q5A  [VSONP-8]
Q6B#3  CSD19531Q5A  [VSONP-8]
R1A#3  value 4.7R  [RES 0402]  (hidden comment: ERJ-PA3J4R7V)
R1B#3  value 4.7R  [RES 0402]  (hidden comment: ERJ-PA3J4R7V)
R1C#1  value 4.7R  [RES 0402]  (hidden comment: ERJ-PA3J4R7V)
R2A#3  value 4.7R  [RES 0402]  (hidden comment: ERJ-PA3J4R7V)
R2B#3  value 4.7R  [RES 0402]  (hidden comment: ERJ-PA3J4R7V)
R3A#3  value 4.7R  [RES 0402]  (hidden comment: ERJ-PA3J4R7V)
R3B#3  value 4.7R  [RES 0402]  (hidden comment: ERJ-PA3J4R7V)
R4A#3  value 4.7R  [RES 0402]  (hidden comment: ERJ-PA3J4R7V)
R4B#3  value 4.7R  [RES 0402]  (hidden comment: ERJ-PA3J4R7V)
R5#2  value 39k  [RES 0402]  (hidden comment: ERJ-2RKF3902X)
R5A#3  value 4.7R  [RES 0402]  (hidden comment: ERJ-PA3J4R7V)
R5B#3  value 4.7R  [RES 0402]  (hidden comment: ERJ-PA3J4R7V)
R6#2  value 2.2k  [RES 0402]  (hidden comment: ERJ-2RKF2201X)
R6A#3  value 4.7R  [RES 0402]  (hidden comment: ERJ-PA3J4R7V)
R6B#3  value 4.7R  [RES 0402]  (hidden comment: ERJ-PA3J4R7V)
R7B#3  value 39k  [RES 0402]  (hidden comment: ERJ-2RKF3902X)
R8B#3  value 39k  [RES 0402]  (hidden comment: ERJ-2RKF3902X)
R9B#3  value 39k  [RES 0402]  (hidden comment: ERJ-2RKF3902X)
R10#3  value 2k  [RES 0402]  (hidden comment: ERT-J0EG202GM)
R10A#3  0.5m  [RES 2512]
R10B#3  0.5m  [RES 2512]
R11#3  value 2.2k  [RES 0402]  (hidden comment: ERJ-2RKF2201X)
R12A#3  0.5m  [RES 2512]
R12B#3  0.5m  [RES 2512]
R13#3  value 10k  [RES 0402]  (hidden comment: ERJ-2RKF1002X)
R13A#4  value 2.2k  [RES 0402]  (hidden comment: ERJ-2RKF2201X)
R13B#4  value 2.2k  [RES 0402]  (hidden comment: ERJ-2RKF2201X)
R14A#4  value 2.2k  [RES 0402]  (hidden comment: ERJ-2RKF2201X)
R14B#4  value 2.2k  [RES 0402]  (hidden comment: ERJ-2RKF2201X)
R15A#3  value 2.2k  [RES 0402]  (hidden comment: ERJ-2RKF2201X)
R15B#3  value 2.2k  [RES 0402]  (hidden comment: ERJ-2RKF2201X)
R16A#3  value 10k  [RES 0402]  (hidden comment: ERJ-2RKF1002X)
R16B#3  value 10k  [RES 0402]  (hidden comment: ERJ-2RKF1002X)
R17A#3  value 10k  [RES 0402]  (hidden comment: ERJ-2RKF1002X)
R17B#3  value 10k  [RES 0402]  (hidden comment: ERJ-2RKF1002X)
R18A#3  value 10k  [RES 0402]  (hidden comment: ERJ-2RKF1002X)
R18B#3  value 10k  [RES 0402]  (hidden comment: ERJ-2RKF1002X)
R25A#3  value 100R  [RES 0402]  (hidden comment: ERJ-2RKF1000X)
R25B#3  value 100R  [RES 0402]  (hidden comment: ERJ-2RKF1000X)
R26A#3  value 100R  [RES 0402]  (hidden comment: ERJ-2RKF1000X)
R26B#3  value 100R  [RES 0402]  (hidden comment: ERJ-2RKF1000X)
R29A#3  value 100R  [RES 0402]  (hidden comment: ERJ-2RKF1000X)
R29B#3  value 100R  [RES 0402]  (hidden comment: ERJ-2RKF1000X)
R30A#3  value 100R  [RES 0402]  (hidden comment: ERJ-2RKF1000X)
R30B#3  value 100R  [RES 0402]  (hidden comment: ERJ-2RKF1000X)
R32A#3  value 100R  [RES 0402]  (hidden comment: ERJ-2RKF1000X)
R32B#3  value 100R  [RES 0402]  (hidden comment: ERJ-2RKF1000X)
R33A#2  value 31.6k  [RES 0402]  (hidden comment: ERJ-2RKF3162X)
R33B#2  value 2.61k  [RES 0402]  (hidden comment: ERJ-2RKF2611X)
R34A#3  value 10k  [RES 0402]  (hidden comment: ERJ-2RKF1002X)
R34B#2  value 10k  [RES 0402]  (hidden comment: ERJ-2RKF1002X)
R35A#2  value 274k  [RES 0402]  (hidden comment: ERJ-2RKF2743X)
R35B#2  value 274k  [RES 0402]  (hidden comment: ERJ-2RKF2743X)
R36A#2  value 133k  [RES 0402]  (hidden comment: ERJ-2RKF1333X)
R36B#2  value 100k  [RES 0402]  (hidden comment: ERJ-2RKF1003X)
R38A#3  value 39k  [RES 0402]  (hidden comment: ERJ-2RKF3902X)
R38B#3  value 39k  [RES 0402]  (hidden comment: ERJ-2RKF3902X)
R40A#3  value 2.2k  [RES 0402]  (hidden comment: ERJ-2RKF2201X)
R40B#3  value 2.2k  [RES 0402]  (hidden comment: ERJ-2RKF2201X)
R41A#2  value 10k  [RES 0402]  (hidden comment: ERJ-2RKF1002X)
R42A#2  value 3.65k  [RES 0402]  (hidden comment: ERJ-2RKF3651X)
R91#2  value 0R  [RES 0402]  (hidden comment: ERJ-2GE0R00X)
U1#2  TPS561201  [SOT-23-6]
U2#1  STM32F405ZGT6  [QFP-144 - P0.5MM]
U3A#2  DRV8353Rs  [QFN-48 - P0.5MM]
U3B#2  DRV8353RS  [QFN-48 - P0.5MM]
Y1B#3  CSTNE8M00G550000R0  value 8MHz  [MuRata CSTN]

### Nets
AUX_H: U2#1.70(PB11)
AUX_L: R1C#1.1 U2#1.69(PB10)
BOOT0: R13#3.2
CAN_D: U2#1.140(PB9)
CAN_R: U2#1.139(PB8)
DCBUS: C20A#3.1 C20B#2.1 C35A#3.2 C36A#3.2 C37A#3.2 JB#4.2(+) Q1A#3.5(D) Q1A#3.6(D) Q1A#3.7(D) Q1A#3.8(D) Q1A#3.9(D) Q1B#3.5(D) Q1B#3.6(D) Q1B#3.7(D) Q1B#3.8(D) Q1B#3.9(D) Q3A#3.5(D) Q3A#3.6(D) Q3A#3.7(D) Q3A#3.8(D) Q3A#3.9(D) Q3B#3.5(D) Q3B#3.6(D) Q3B#3.7(D) Q3B#3.8(D) Q3B#3.9(D) Q5A#3.5(D) Q5A#3.6(D) Q5A#3.7(D) Q5A#3.8(D) Q5A#3.9(D) Q5B#3.5(D) Q5B#3.6(D) Q5B#3.7(D) Q5B#3.8(D) Q5B#3.9(D) R35A#2.2 R35B#2.2 R38A#3.2 R38B#3.2 U3A#2.6(VDRAIN) U3A#2.43(VIN) U3B#2.6(VDRAIN) U3B#2.43(VIN)
EN_GATE: U2#1.73(PB12) U3A#2.33(ENABLE) U3B#2.33(ENABLE)
GND: C1B#3.2 C2B#3.2 C3A#3.2 C3B#3.2 C4A#3.2 C5A#3.2 C6A#3.2 C7A#3.2 C8A#3.2 C10A#3.2 C11A#3.2 C12A#3.1 C12B#3.1 C13A#3.1 C13B#3.1 C14A#3.1 C14B#3.1 C18A#2.2 C18B#3.2 C22A#2.1 C22B#3.1 C23A#2.1 C23B#3.1 C30A#3.2 C33A#3.2 C33B#2.2 C34A#3.2 C34B#3.2 C38A#2.2 C38B#3.2 C40A#2.2 D1A#3.2(K) D1B#3.2(K) D3A#3.1(A) D3B#2.1(A) JHA#3.1 JHB#3.1 R6#2.1 R11#3.1 R13#3.1 R33A#2.1 R33B#2.1 R36A#2.2 R36B#2.2 R40A#3.1 R40B#3.1 R41A#2.1 R91#2.1 U1#2.1(GND) U3A#2.0(EPAD) U3A#2.1(GND) U3A#2.27(AGND) U3A#2.41(DGND) U3B#2.0(EPAD) U3B#2.1(GND) U3B#2.27(AGND) U3B#2.41(DGND) Y1B#3.2
GPIO_1: U2#1.34(PA0(ADC123_IN0/WKUP))
GPIO_2: U2#1.35(PA1(ADC123_IN1))
GPIO_3: U2#1.36(PA2(ADC123_IN2))
GPIO_4: U2#1.37(PA3(ADC123_IN3))
GPIO_5: U2#1.48(BOOT1_/_PB2)
M0_AH: U2#1.100(PA8) U3A#2.34(INHA)
M0_AL: U2#1.74(PB13(OTG_HS_VBUS)) U3A#2.35(INLA)
M0_BH: U2#1.101(PA9(OTG_FS_VBUS)) U3A#2.36(INHB)
M0_BL: U2#1.75(PB14) U3A#2.37(INLB)
M0_CH: U2#1.102(PA10) U3A#2.38(INHC)
M0_CL: U2#1.76(PB15) U3A#2.39(INLC)
M0_DC_CAL: U2#1.99(PC9)
M0_ENC_A: C14A#3.2 R18A#3.2 U2#1.134(PB4(NJTRST))
M0_ENC_A_IN: JHA#3.4 R15A#3.1 R18A#3.1
M0_ENC_B: C13A#3.2 R17A#3.2 U2#1.135(PB5)
M0_ENC_B_IN: JHA#3.3 R14A#4.1 R17A#3.1
M0_ENC_Z: C12A#3.2 R16A#3.2 U2#1.110(PA15(JTDI))
M0_ENC_Z_IN: JHA#3.2 R13A#4.1 R16A#3.1
M0_GH_A: R3A#3.1 U3A#2.8(GHA)
M0_GH_B: R1A#3.1 U3A#2.17(GHB)
M0_GH_C: R5A#3.1 U3A#2.18(GHC)
M0_GL_A: R4A#3.1 U3A#2.10(GLA)
M0_GL_B: R2A#3.1 U3A#2.15(GLB)
M0_GL_C: R6A#3.1 U3A#2.20(GLC)
M0_nCS: U2#1.7(PC13_(RTC_AF1)) U3A#2.32(~{CS})
M0_SH_A: Q3A#3.1(S) Q3A#3.2(S) Q3A#3.3(S) Q4A#3.5(D) Q4A#3.6(D) Q4A#3.7(D) Q4A#3.8(D) Q4A#3.9(D) U3A#2.9(SHA)
M0_SH_B: Q1A#3.1(S) Q1A#3.2(S) Q1A#3.3(S) Q2A#3.5(D) Q2A#3.6(D) Q2A#3.7(D) Q2A#3.8(D) Q2A#3.9(D) U3A#2.16(SHB)
M0_SH_C: Q5A#3.1(S) Q5A#3.2(S) Q5A#3.3(S) Q6A#3.5(D) Q6A#3.6(D) Q6A#3.7(D) Q6A#3.8(D) Q6A#3.9(D) U3A#2.19(SHC)
M0_SN_1: R10A#3.1 R26A#3.2
M0_SN_1_F: C15A#3.1 R26A#3.1 U3A#2.13(SNB)
M0_SN_2: R12A#3.2 R30A#3.2
M0_SN_2_F: C17A#3.1 R30A#3.1 U3A#2.22(SNC)
M0_SO1: U2#1.26(PC0(ADC123_IN10)) U3A#2.24(SOB)
M0_SO2: U2#1.27(PC1(ADC123_IN11)) U3A#2.23(SOC)
M0_SP_1: Q2A#3.1(S) Q2A#3.2(S) Q2A#3.3(S) R10A#3.2 R25A#3.2
M0_SP_1_F: C15A#3.2 R25A#3.1 U3A#2.14(SPB)
M0_SP_2: Q6A#3.1(S) Q6A#3.2(S) Q6A#3.3(S) R12A#3.1 R29A#3.2
M0_SP_2_F: C17A#3.2 R29A#3.1 U3A#2.21(SPC)
M0_TEMP: R10#3.1 R11#3.2
M1_AH: U2#1.96(PC6) U3B#2.34(INHA)
M1_AL: U2#1.43(PA7(ADC12_IN7)) U3B#2.35(INLA)
M1_BH: U2#1.97(PC7) U3B#2.36(INHB)
M1_BL: U2#1.46(PB0(ADC12_IN8)) U3B#2.37(INLB)
M1_CH: U2#1.98(PC8) U3B#2.38(INHC)
M1_CL: U2#1.47(PB1(ADCIN12_IN9)) U3B#2.39(INLC)
M1_DC_CAL: U2#1.9(PC15-OSC32_OUT)
M1_ENC_A: C14B#3.2 R18B#3.2 U2#1.136(PB6)
M1_ENC_A_IN: JHB#3.4 R15B#3.1 R18B#3.1
M1_ENC_B: C13B#3.2 R17B#3.2 U2#1.137(PB7)
M1_ENC_B_IN: JHB#3.3 R14B#4.1 R17B#3.1
M1_ENC_Z: C12B#3.2 R16B#3.2 U2#1.133(PB3(JTDO/TRACESWO))
M1_ENC_Z_IN: JHB#3.2 R13B#4.1 R16B#3.1
M1_GH_A: R3B#3.1 U3B#2.8(GHA)
M1_GH_B: R1B#3.1 U3B#2.17(GHB)
M1_GH_C: R5B#3.1 U3B#2.18(GHC)
M1_GL_A: R4B#3.1 U3B#2.10(GLA)
M1_GL_B: R2B#3.1 U3B#2.15(GLB)
M1_GL_C: R6B#3.1 U3B#2.20(GLC)
M1_nCS: U2#1.8(PC14-OSC32_IN) U3B#2.32(~{CS})
M1_SH: Q5B#3.1(S) Q5B#3.2(S) Q5B#3.3(S) Q6B#3.5(D) Q6B#3.6(D) Q6B#3.7(D) Q6B#3.8(D) Q6B#3.9(D) U3B#2.19(SHC)
M1_SH_A: Q3B#3.1(S) Q3B#3.2(S) Q3B#3.3(S) Q4B#3.5(D) Q4B#3.6(D) Q4B#3.7(D) Q4B#3.8(D) Q4B#3.9(D) U3B#2.9(SHA)
M1_SH_B: Q1B#3.1(S) Q1B#3.2(S) Q1B#3.3(S) Q2B#3.5(D) Q2B#3.6(D) Q2B#3.7(D) Q2B#3.8(D) Q2B#3.9(D) U3B#2.16(SHB)
M1_SN_1: R10B#3.1 R26B#3.2
M1_SN_1_F: C15B#3.1 R26B#3.1 U3B#2.13(SNB)
M1_SN_2: R12B#3.2 R30B#3.2
M1_SN_2_F: C17B#3.1 R30B#3.1 U3B#2.22(SNC)
M1_SO1: U2#1.28(PC2(ADC123_IN12)) U3B#2.24(SOB)
M1_SO2: U2#1.29(PC3(ADC123_IN13)) U3B#2.23(SOC)
M1_SP_1: Q2B#3.1(S) Q2B#3.2(S) Q2B#3.3(S) R10B#3.2 R25B#3.2
M1_SP_1_F: C15B#3.2 R25B#3.1 U3B#2.14(SPB)
M1_SP_2: Q6B#3.1(S) Q6B#3.2(S) Q6B#3.3(S) R12B#3.1 R29B#3.2
M1_SP_2_F: C17B#3.2 R29B#3.1 U3B#2.21(SPC)
mA_AGND: C34A#4.2
mA_AN_IN: R38A#3.1 R40A#3.2
mA_DVDD: C23A#2.2 U3A#2.40(DVDD)
mA_LED_GREEN: R32A#3.2
mA_PA_SOURCE: C35A#3.1 C36A#3.1 C37A#3.1 JB#4.1(-) Q1C#1.1(S) Q1C#1.2(S) Q1C#1.3(S) Q2C#1.1(S) Q2C#1.2(S) Q2C#1.3(S) Q4A#3.1(S) Q4A#3.2(S) Q4A#3.3(S) Q4B#3.1(S) Q4B#3.2(S) Q4B#3.3(S) U3A#2.11(SPA) U3A#2.12(SNA) U3B#2.11(SPA) U3B#2.12(SNA)  [also labelled mB_PA_SOURCE, PGND]
MA_VSSA: C9A#3.2 R91#2.2
mB_AN_IN: R38B#3.1 R40B#3.2
mB_DVDD: C23B#3.2 U3B#2.40(DVDD)
mB_eStop: R7B#3.1 R8B#3.1 R9B#3.1
mB_LED_GREEN: R32B#3.2
nFAULT: U2#1.81(PD12) U3A#2.28(nFAULT) U3B#2.28(nFAULT)
NRST: C3A#3.1 C3B#3.1
SPI_MISO: U2#1.112(PC11) U3A#2.29(SDO) U3B#2.29(SDO)
SPI_MOSI: U2#1.113(PC12) U3A#2.30(SDI) U3B#2.30(SDI)
SPI_SCK: U2#1.111(PC10) U3A#2.31(SCK) U3B#2.31(SCK)
SWDCLK: U2#1.109(PA14(JTCK-SWDCLK))
SWDIO: U2#1.105(PA13(JTMS-SWDIO))
USB_DM: U2#1.103(PA11)
USB_DP: U2#1.104(PA12)
V_CHG: R5#2.2
V_CHG_SNS: R5#2.1 R6#2.2
VBUS_S: U2#1.42(PA6(ADC12_IN6))
VCC_3V3: C4A#3.1 C5A#3.1 C6A#3.1 C7A#3.1 C8A#3.1 C10A#3.1 C33A#3.1 C34A#3.1 C34A#4.1 C34B#3.1 C40A#2.1 JHA#3.5 JHB#3.5 L1#2.1 L1A#2.2 R10#3.2 R13A#4.2 R13B#4.2 R14A#4.2 R14B#4.2 R15A#3.2 R15B#3.2 R34A#3.2 R42A#2.1 U3A#2.26(VREF) U3B#2.26(VREF)
VCC_3V3_SD: R35A#2.1 U3A#2.47(RT/SD)
VCC_12V: C33B#2.1 C38A#2.1 C38B#3.1 L1B#2.2 R34B#2.2 U1#2.3(VIN) U1#2.5(EN) U3A#2.5(VM) U3B#2.5(VM)
VCC_12V_SD: R35B#2.1 U3B#2.47(RT/SD)
VDDA: C9A#3.1
NetC1B#3_1: C1B#3.1 Y1B#3.3
NetC2B#3_1: C2B#3.1 Y1B#3.1
NetC18A#2_1: C18A#2.1 U3A#2.2(VGLS)
NetC18B#3_1: C18B#3.1 U3B#2.2(VGLS)
NetC19A#2_1: C19A#2.1 U3A#2.3(CPL)
NetC19A#2_2: C19A#2.2 U3A#2.4(CPH)
NetC19B#2_1: C19B#2.1 U3B#2.3(CPL)
NetC19B#2_2: C19B#2.2 U3B#2.4(CPH)
NetC20A#3_2: C20A#3.2 U3A#2.7(VCP)
NetC20B#2_2: C20B#2.2 U3B#2.7(VCP)
NetC21A#2_1: C21A#2.1 U3A#2.45(BST)
NetC21A#2_2: C21A#2.2 D3A#3.2(K) L1A#2.1 U3A#2.42(SW)
NetC21B#2_1: C21B#2.1 U3B#2.45(BST)
NetC21B#2_2: C21B#2.2 D3B#2.2(K) L1B#2.1 U3B#2.42(SW)
NetC22A#2_2: C22A#2.2 U3A#2.44(VCC)
NetC22B#3_2: C22B#3.2 U3B#2.44(VCC)
NetC41A#2_1: C41A#2.1 L1#2.2 U1#2.2(SW)
NetC41A#2_2: C41A#2.2 U1#2.6(VBST)
NetD1A#3_1: D1A#3.1(A) R32A#3.1
NetD1B#3_1: D1B#3.1(A) R32B#3.1
NetQ1A#3_4: Q1A#3.4(G) R1A#3.2
NetQ1B#3_4: Q1B#3.4(G) R1B#3.2
NetQ1C#1_4: Q1C#1.4(G) Q2C#1.4(G) R1C#1.2
NetQ1C#1_5: Q1C#1.5(D) Q1C#1.6(D) Q1C#1.7(D) Q1C#1.8(D) Q1C#1.9(D) Q2C#1.5(D) Q2C#1.6(D) Q2C#1.7(D) Q2C#1.8(D) Q2C#1.9(D)
NetQ2A#3_4: Q2A#3.4(G) R2A#3.2
NetQ2B#3_4: Q2B#3.4(G) R2B#3.2
NetQ3A#3_4: Q3A#3.4(G) R3A#3.2
NetQ3B#3_4: Q3B#3.4(G) R3B#3.2
NetQ4A#3_4: Q4A#3.4(G) R4A#3.2
NetQ4B#3_4: Q4B#3.4(G) R4B#3.2
NetQ5A#3_4: Q5A#3.4(G) R5A#3.2
NetQ5B#3_4: Q5B#3.4(G) R5B#3.2
NetQ6A#3_4: Q6A#3.4(G) R6A#3.2
NetQ6B#3_4: Q6B#3.4(G) R6B#3.2
NetR33A#2_2: R33A#2.2 R34A#3.1 U3A#2.48(FB)
NetR33B#2_2: R33B#2.2 R34B#2.1 U3B#2.48(FB)
NetR36A#2_1: R36A#2.1 U3A#2.46(RCL)
NetR36B#2_1: R36B#2.1 U3B#2.46(RCL)
NetR41A#2_2: R41A#2.2 R42A#2.2 U1#2.4(VFB)

Not connected (* = marked no-connect by the designer): C11A#3 1; C30A#3 1; R7B#3 2; R8B#3 2; R9B#3 2; U2#1 1(PE2) 2(PE3) 3(PE4) 4(PE5) 5(PE6) 6(VBAT) 10(PF0) 11(PF1) 12(PF2) 13(PF3) 14(PF4) 15(PF5) 16(VSS) 17(VDD) 18(PF6) 19(PF7) 20(PF8) 21(PF9) 22(PF10) 23(PH0-OSC_IN) 24(PH1-OSC_OUT) 25(NRST) 30(VDD) 31(VSSA) 32(VREF+) 33(VDDA) 38(VSS) 39(VDD) 40(PA4(ADC12_IN4/DAC1_OUT)) 41(PA5(ADC12_IN5/DAC2_OUT)) 44(PC4(ADC123_IN14)) 45(PC5(ADC123_IN15)) 49(PF11) 50(PF12) 51(VSS) 52(VDD) 53(PF13) 54(PF14) 55(PF15) 56(PG0) 57(PG1) 58(PE7) 59(PE8) 60(PE9) 61(VSS) 62(VDD) 63(PE10) 64(PE11) 65(PE12) 66(PE13) 67(PE14) 68(PE15) 71(VCAP1) 72(VDD) 77(PD8) 78(PD9) 79(PD10) 80(PD11) 82(PD13) 83(VSS) 84(VDD) 85(PD14) 86(PD15) 87(PG2) 88(PG3) 89(PG4) 90(PG5) 91(PG6) 92(PG7) 93(PG8) 94(VSS) 95(VDD) 106(VCAP2) 107(VSS) 108(VDD) 114(PD0) 115(PD1) 116(PD2) 117(PD3) 118(PD4) 119(PD5) 120(VSS) 121(VDD) 122(PD6) 123(PD7) 124(PG9) 125(PG10) 126(PG11) 127(PG12) 128(PG13) 129(PG14) 130(VSS) 131(VDD) 132(PG15) 138(BOOT0) 141(PE0) 142(PE1) 143(PDR_ON) 144(VDD); U3A#2 25(SOA); U3B#2 25(SOA)

### Notes on the sheet
- Labels drawn without touching a wire or pin: BUSFET, CHARGEPUMP, mB_MISO_ADC_EXT2, V_CHG
- (in symbol CSD19531Q5A) 5,6,; 7,8; 1,2,3

### Library data of the parts
C1B#3 C2B#3 = GCM1555C1H180JA16D: CAP 0402 18pF 50V (NP0 Dielectric); WVDC: 50
C3A#3 C3B#3 C41A#2 = C0402C104K3RACTU: CAP 0402 100nF 10V; WVDC: 25
C4A#3 C5A#3 C6A#3 C7A#3 C8A#3 C9A#3 C10A#3 C11A#3 C18A#2 C18B#3 C22A#2 C22B#3 C23A#2 C23B#3 C30A#3 C34A#3 C34A#4 C34B#3 C38A#2 C38B#3 = GRM155C81C225ME15D: CAP 0402 2.2uF 16V; WVDC: 16
C12A#3 C12B#3 C13A#3 C13B#3 C14A#3 C14B#3 C15A#3 C15B#3 C17A#3 C17B#3 = GCM155R72A222KA37D: CAP 0402 2.2nF 100V (X7R DIELECTRIC); WVDC: 100
C19A#2 C19B#2 = C0603C473K1RECAUTO: CAP 0603 47nF 100V (X7R DIELECTRIC); WVDC: 100
C20A#3 C20B#2 = GRJ31CR72A105KE11L: CAP 1206 1uF 100V; WVDC: 100
C21A#2 C21B#2 = GCM155R71E103JA37D: CAP 0402 10nF 25V; WVDC: 25
C33A#3 C33B#2 C40A#2 = TMK316AB7106KL-T: CAP 1206 10uF 25V; WVDC: 25
C35A#3 C36A#3 C37A#3 = CGA6M3X7S2A475M200AB: CAP 1206 4.7uF 100V; WVDC: 100
D1A#3 D1B#3 = LTST-C190KRKT: RED LED
D3A#3 D3B#2 = NSR02100HT1G: Schottky Diodes & Rectifiers 100V; Vrrm: 100; If: 200mA
JB#4 = XT30_S: XT30 SOCKET
L1#2 = LQM2HPN4R7MG0L: Fixed Inductors 1008 4.7uH 20% 1.1A
L1A#2 L1B#2 = SDE0805A-331K: Fixed Inductors 330uH 10% SMD 0805 AEC-Q200; Isat: 400mA
Q1A#3 Q1B#3 Q1C#1 Q2A#3 Q2B#3 Q2C#1 Q3A#3 Q3B#3 Q4A#3 Q4B#3 Q5A#3 Q5B#3 Q6A#3 Q6B#3 = CSD19531Q5A: 100V 100A VSONP-8 5.3mOhm Pwr MOSFET; Manufacturer: Texas Instruments; Value2: 48 nC; QgTyp_nC: 48; SizeAreaWB_mm2: 56; SizeArea_mm2: 30; SizeX_mm: 6; SizeY_mm: 5; SizeZ_mm: 1; PartNumber: CSD19531Q5A; Value: 100V; VdsMax_V: 100V; Vgs_V: 100V; IdsMax_A: 100A; RoHS: Y; ComponentLink1Description: Datasheet link
R1A#3 R1B#3 R1C#1 R2A#3 R2B#3 R3A#3 R3B#3 R4A#3 R4B#3 R5A#3 R5B#3 R6A#3 R6B#3 = ERJ-PA3J4R7V: RES 0402 4.7R 5%
R5#2 R7B#3 R8B#3 R9B#3 R38A#3 R38B#3 = ERJ-2RKF3902X: RES 0402 39k 1%
R6#2 R11#3 R13A#4 R13B#4 R14A#4 R14B#4 R15A#3 R15B#3 R40A#3 R40B#3 = ERJ-2RKF2201X: RES 0402 2.2k 1%
R10#3 = ERT-J0EG202GM: NTC THERMISTOR 0402 2k 2%
R10A#3 R10B#3 R12A#3 R12B#3 = CSR2512C0R0005F: RES SMD 0.0005 OHM 1% 3W 2512; Manufacturer: Riedon; Temperature Coefficient: ±100ppm/°C; Supplier 1: Digi-Key; Supplier Part Number 1: 696-1183-2-ND; RoHS: RoHS Compliant; Category: Resistors; Stock: 2000; Pricing 1: 2000=0.19817, 6000=0.1937, 10000=0.187, 50000=0.18148 (USD); Packaging: Tape & Reel (TR); Part Status: Active; Tolerance: ±1%; Power (Watts): 3W; Composition: Metal Element; Features: Current Sense; Operating Temperature: -55°C ~ 170°C; Package / Case: 2512 (6432 Metric); Supplier Device Package: 2512; Size / Dimension: 0.250" L x 0.118" W (6.35mm x 3.00mm); Height - Seated (Max): 0.057" (1.45mm); Failure Rate: -; ComponentLink1URL: http://riedon.com/media/pdf/CSR.pdf; ComponentLink1Description: http://riedon.com/media/pdf/CSR.pdf; Supplier 2: Digi-Key; Supplier Part Number 2: 696-1183-1-ND; Pricing 2: 1=0.69, 10=0.574, 25=0.4916, 50=0.4426, 100=0.3852, 250=0.3442, 500=0.27864, 1000=0.22536 (USD); Manufacturer Part Number: CSR2512C0R0005F
R13#3 R16A#3 R16B#3 R17A#3 R17B#3 R18A#3 R18B#3 R34A#3 R34B#2 R41A#2 = ERJ-2RKF1002X: RES 0402 10k 1%
R25A#3 R25B#3 R26A#3 R26B#3 R29A#3 R29B#3 R30A#3 R30B#3 R32A#3 R32B#3 = ERJ-2RKF1000X: RES 0402 100R 1%
R33A#2 = ERJ-2RKF3162X: RES 0402 31.6k 1%
R33B#2 = ERJ-2RKF2611X: RES 0402 2.61k 1%
R35A#2 R35B#2 = ERJ-2RKF2743X: RES 0402 274k 1%
R36A#2 = ERJ-2RKF1333X: RES 0402 133k 1%
R36B#2 = ERJ-2RKF1003X: RES 0402 100k 1%
R42A#2 = ERJ-2RKF3651X: RES 0402 3.65k 1%
R91#2 = ERJ-2GE0R00X: RES 0402 0R
U1#2 = TPS561201: 4.5V to 17V Input, 1A Synchronous Step-Down Voltage Regulator in 6-pin SOT-23
U2#1 = STM32F405ZGT6: Cortex M4 MCU
U3A#2 U3B#2 = DRV8353RS: 100V Three Phase Gate Driver With 3 Current Shunt Amplifiers and Buck Regulator
Y1B#3 = CSTNE8M00G550000R0: Ceramic Resonator 8.0000MHz 33pf 0.5%